# EAGLE board SOM EVAL BOARD V1.1 (EAGLE 9.4.2), part 1 of 2
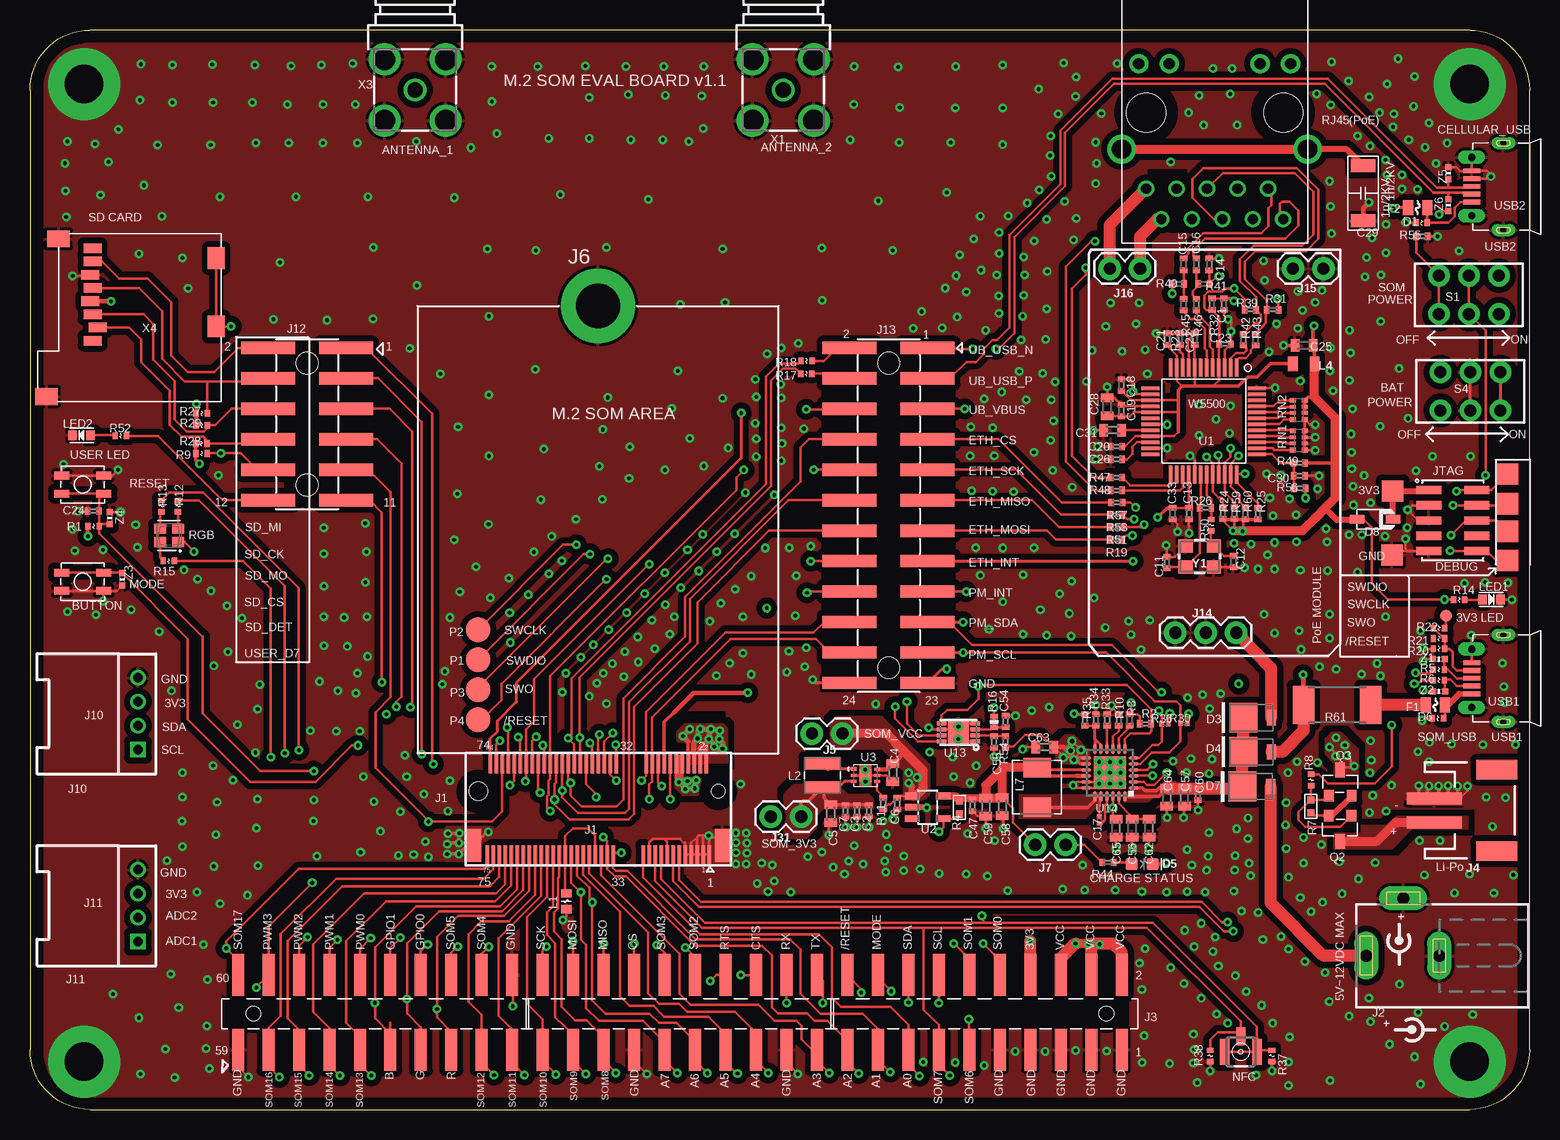
[diagram p3: board, top side]
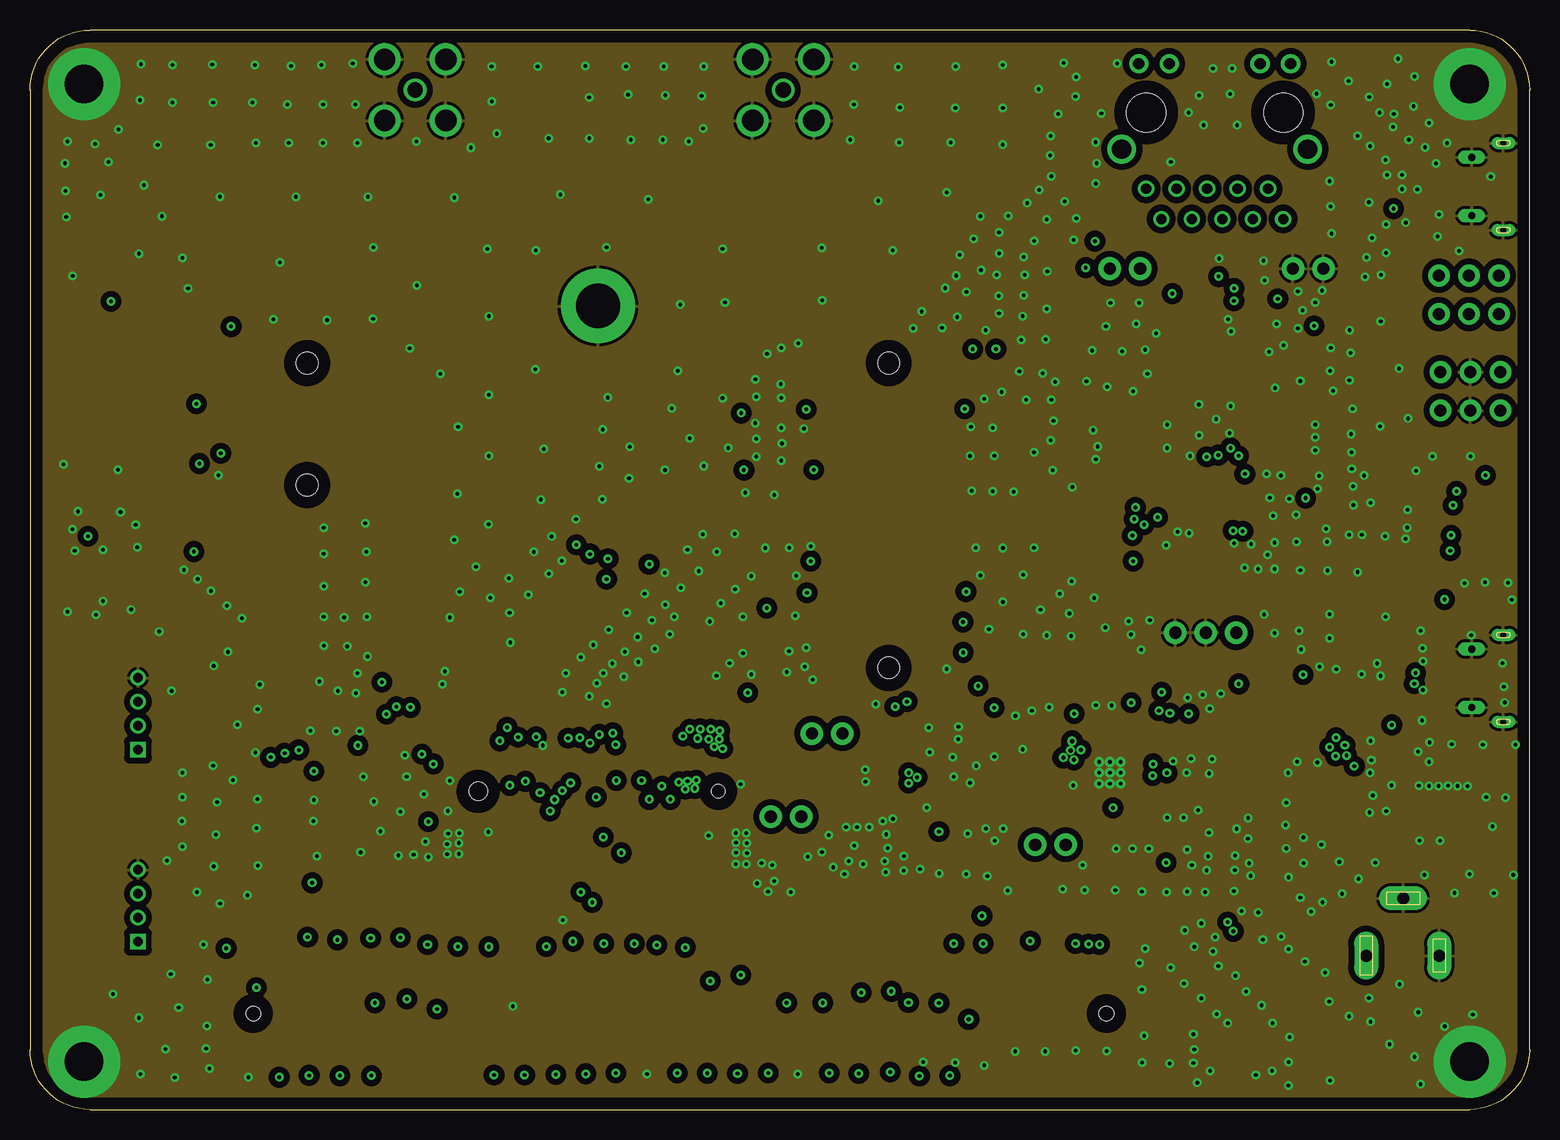
[diagram p4: board, inner layer Route2]
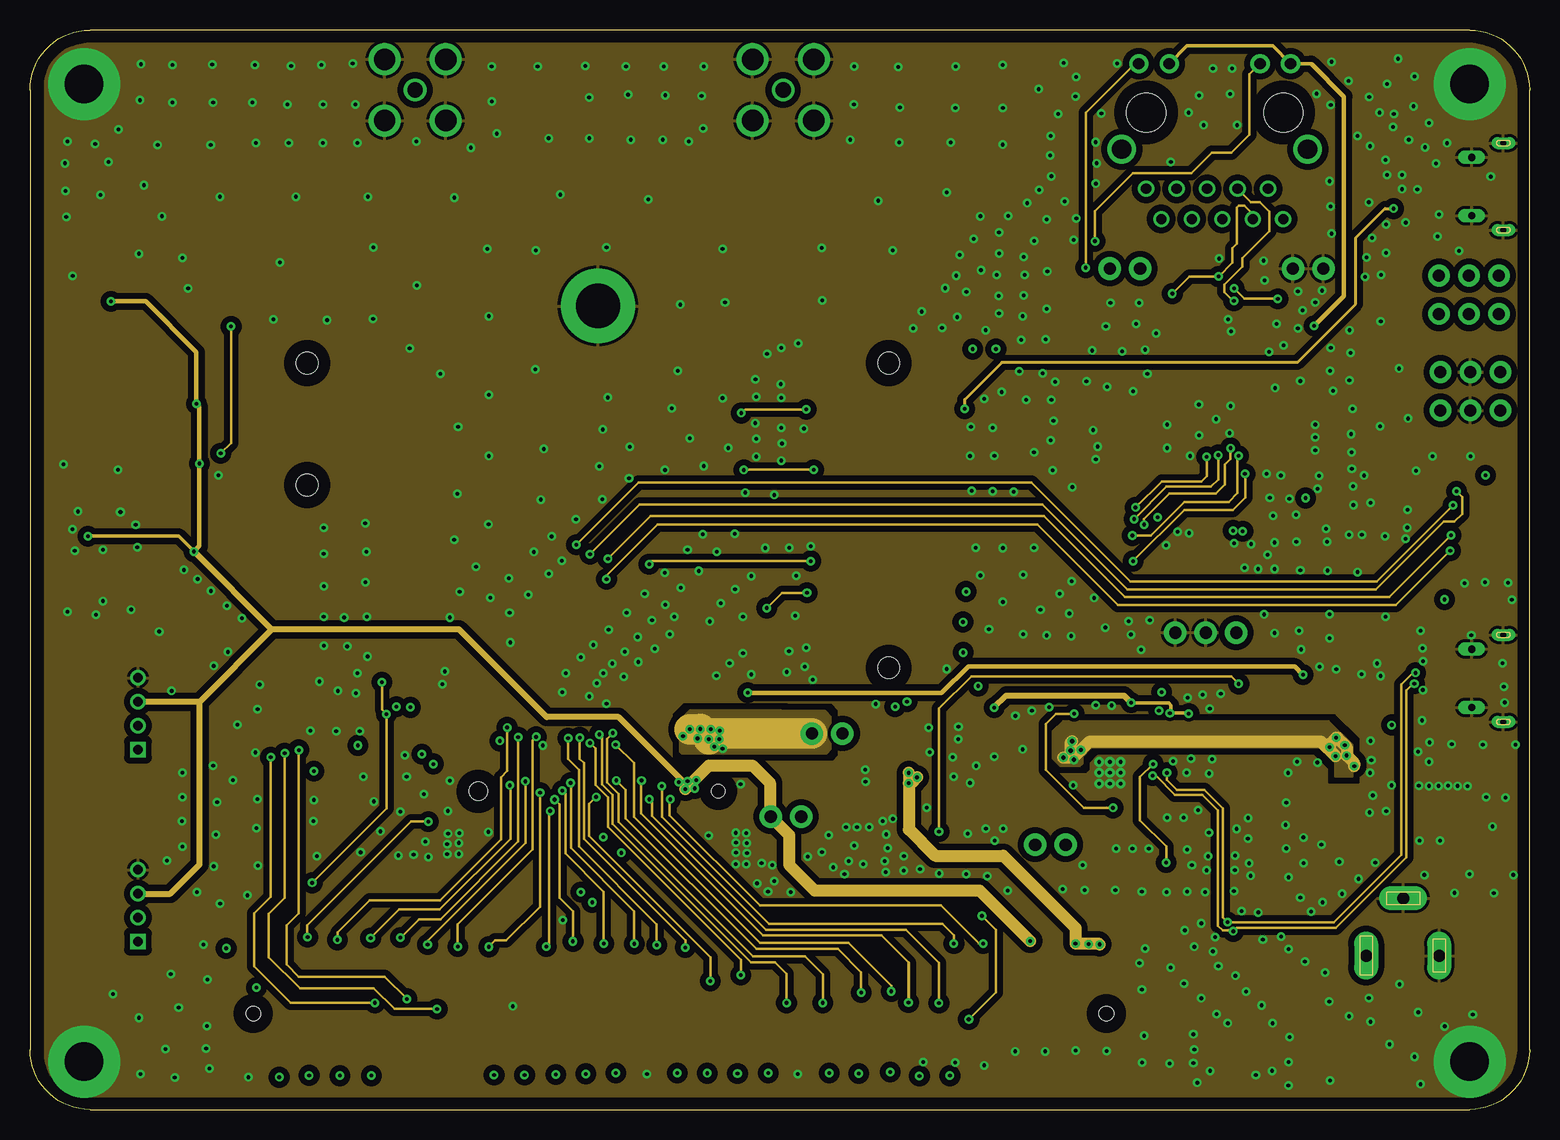
[diagram p5: board, inner layer Route15]
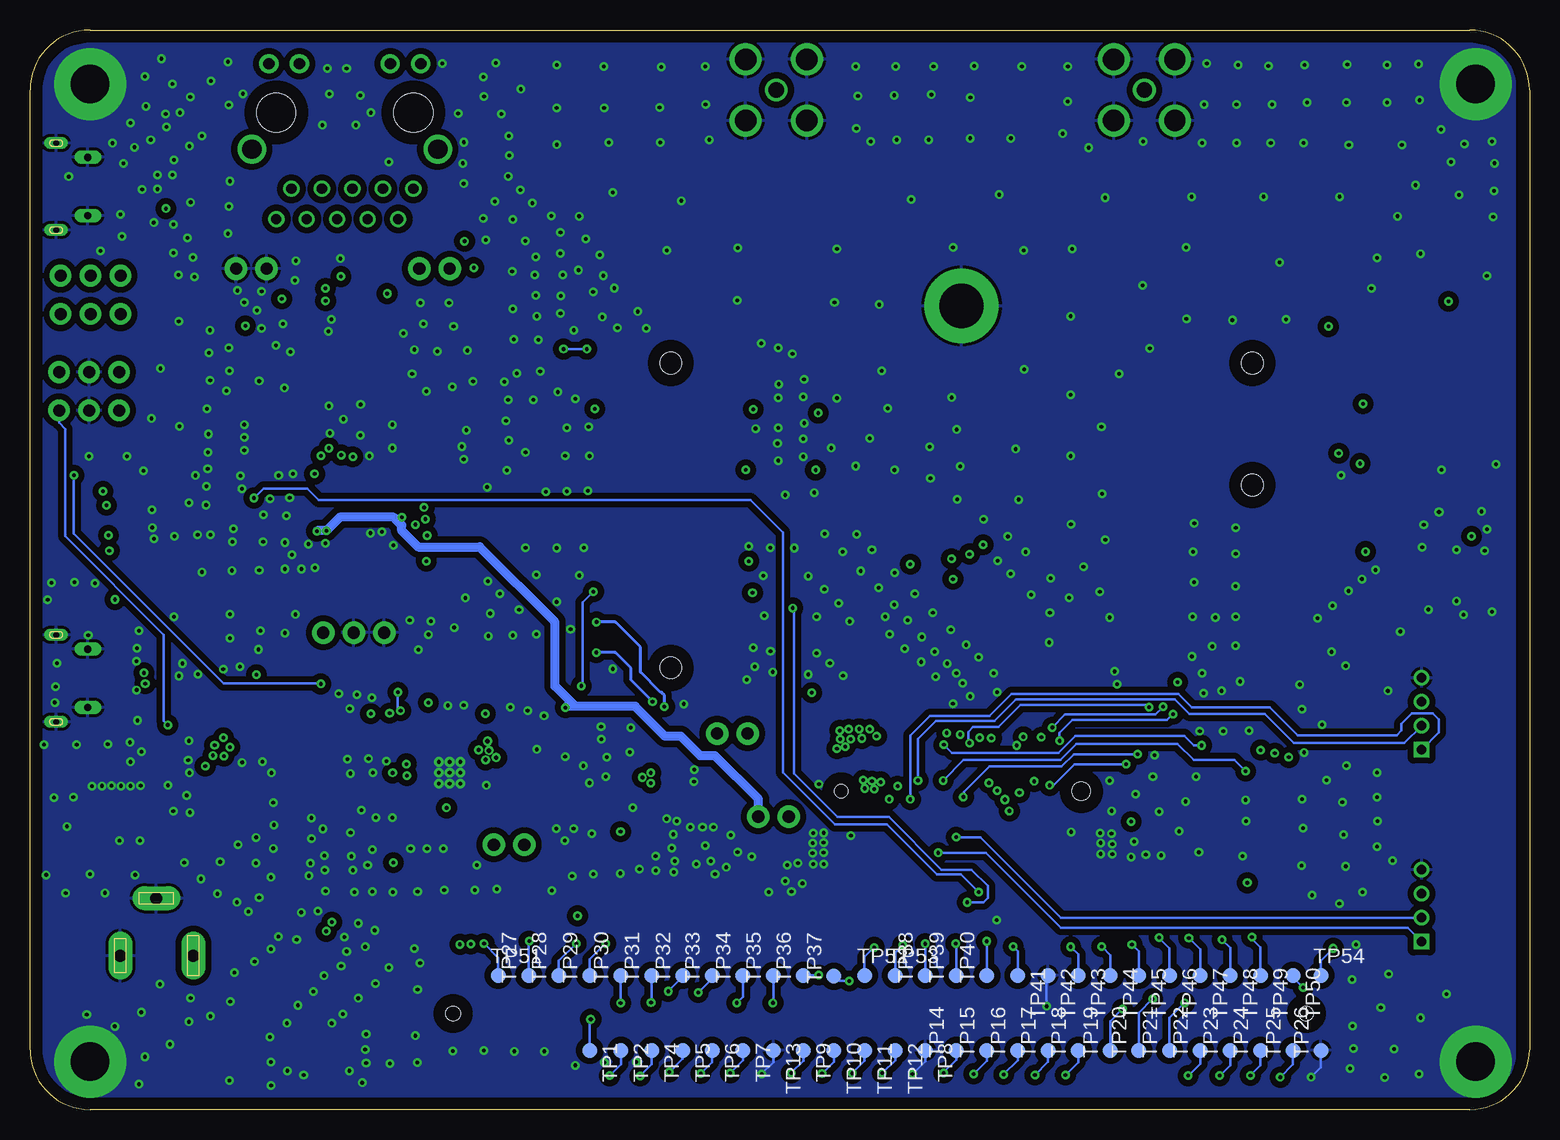
[diagram p6: board, bottom side, seen from below]

Size 125 x 90 mm. Coordinates in mm from the lower left corner, seen from the top.
Outline: 5,0 120,0 arc90 125,5 125,85 arc90 120,90 5,90 arc90 0,85 0,5 arc90 5,0
Copper layers (1+2*15+16): Top 0.035mm / dielectric 1.5mm / Route2 0.035mm / dielectric 0.15mm / Route15 0.035mm / dielectric 0.2mm / Bottom 0.035mm
Design rules "default *": minimum track width 8mil, minimum drill 12mil, track to track 8mil, track to pad 6mil, pad to pad 6mil, via to via 6mil, smd to smd 6mil, copper to edge 40mil, drill to drill 6mil, minimum pad ring 10mil, minimum via ring 8mil, stop-mask expansion 4mil, vias tented up to drill 20mil, thermal gap 10mil
Net classes: 0 default: width 0.152 mm, clearance 0.152 mm; 1 power: width 0.254 mm, drill 0.61 mm, clearance 0.203 mm; 3 BAT: clearance 0.203 mm; 4 3V3: width 0.305 mm, clearance 0.508 mm; 6 +3V3: width 0.203 mm, clearance 0.152 mm

## Footprints (pad centres in the part's own frame; a part is rotated, then mirrored left to right if it is on the bottom)
TS-1185A-020 = smd 1.27 x 0.635: 1 -1.75,0.752; 2 1.75,0.752; 3 -1.75,-0.752; 4 1.75,-0.752
C0402_B = smd 0.457 x 0.61: 1 -0.483,0; 2 0.483,0
C0603_B = smd 0.711 x 1.041: 1 -0.749,0; 2 0.749,0
C0201_B = smd 0.356 x 0.406: 1 -0.279,0; 2 0.279,0
C-1808 = smd 1.1 x 2.05: P$1 -2.285,0; P$2 2.285,0
R-0402S = smd 0.45 x 0.55: 1 -0.47,0; 2 0.47,0
DIODE-DO-220AA_NT(SMP) = smd 0.762 x 1.27: ANODE 2.349,0 | smd 2.337 x 2.464: CATHODE 0,0
LED-0603 = smd 1 x 1: A -0.877,0; C 0.877,0
SOD-123 = smd 1.2 x 0.7: 1 -1.5,0; 2 1.5,0
CON5X2_1.27 = smd 0.7 x 2.1: 1 -2.54,-2; 2 -2.54,2; 3 -1.27,-2; 4 -1.27,2; 5 0,-2; 6 0,2; 7 1.27,-2; 8 1.27,2; 9 2.54,-2; 10 2.54,2
F0805 = smd 0.85 x 1.25: P$1 -0.8,0; P$2 0.8,0
M.2EKEY = smd 0.3 x 1.55: 1 -9.62,3.735; 2 -9.37,-3.815; 3 -9.12,3.735; 4 -8.87,-3.815; 5 -8.62,3.735; 6 -8.37,-3.815; 7 -8.12,3.735; 8 -7.87,-3.815; 9 -7.62,3.735; 10 -7.37,-3.815; 11 -7.12,3.735; 12 -6.87,-3.815; 13 -6.62,3.735; 14 -6.37,-3.815; 15 -6.12,3.735; 16 -5.87,-3.815; 17 -5.62,3.735; 18 -5.37,-3.815; 19 -5.12,3.735; 20 -4.87,-3.815; 21 -4.62,3.735; 22 -4.37,-3.815; 23 -4.12,3.735; 32 -1.87,-3.815; 33 -1.62,3.735; 34 -1.37,-3.815; 35 -1.12,3.735; 36 -0.87,-3.815; 37 -0.62,3.735; 38 -0.37,-3.815; 39 -0.12,3.735; 40 0.13,-3.815; 41 0.38,3.735; 42 0.63,-3.815; 43 0.88,3.735; 44 1.13,-3.815; 45 1.38,3.735; 46 1.63,-3.815; 47 1.88,3.735; 48 2.13,-3.815; 49 2.38,3.735; 50 2.63,-3.815; 51 2.88,3.735; 52 3.13,-3.815; 53 3.38,3.735; 54 3.63,-3.815; 55 3.88,3.735; 56 4.13,-3.815; 57 4.38,3.735; 58 4.63,-3.815; 59 4.88,3.735; 60 5.13,-3.815; 61 5.38,3.735; 62 5.63,-3.815; 63 5.88,3.735; 64 6.13,-3.815; 65 6.38,3.735; 66 6.63,-3.815; 67 6.88,3.735; 68 7.13,-3.815; 69 7.38,3.735; 70 7.63,-3.815; 71 7.88,3.735; 72 8.13,-3.815; 73 8.38,3.735; 74 8.63,-3.815; 75 8.88,3.735 | smd 1.2 x 2.75: 76 9.98,2.96; 77 -10.72,2.96 | hole 1.1: -10.37,-1.54 | hole 1.55: 9.63,-1.54
DCJ0202 = drill 1 pad 2 long: 1 0,3.1; 2 4.8,0; 3 0,-3
SPARK_CON_30X2_SMD = smd 1 x 3.5: 1 0,3.013; 2 0,-3.213; 3 2.54,3.013; 4 2.54,-3.213; 5 5.08,3.013; 6 5.08,-3.213; 7 7.62,3.013; 8 7.62,-3.213; 9 10.16,3.013; 10 10.16,-3.213; 11 12.7,3.013; 12 12.7,-3.213; 13 15.24,3.013; 14 15.24,-3.213; 15 17.78,3.013; 16 17.78,-3.213; 17 20.32,3.013; 18 20.32,-3.213; 19 22.86,3.013; 20 22.86,-3.213; 21 25.4,3.013; 22 25.4,-3.213; 23 27.94,3.013; 24 27.94,-3.213; 25 30.48,3.013; 26 30.48,-3.213; 27 33.02,3.013; 28 33.02,-3.213; 29 35.56,3.013; 30 35.56,-3.213; 31 38.1,3.013; 32 38.1,-3.213; 33 40.64,3.013; 34 40.64,-3.213; 35 43.18,3.013; 36 43.18,-3.213; 37 45.72,3.013; 38 45.72,-3.213; 39 48.26,3.013; 40 48.26,-3.213; 41 50.8,3.013; 42 50.8,-3.213; 43 53.34,3.013; 44 53.34,-3.213; 45 55.88,3.013; 46 55.88,-3.213; 47 58.42,3.013; 48 58.42,-3.213; 49 60.96,3.013; 50 60.96,-3.213; 51 63.5,3.013; 52 63.5,-3.213; 53 66.04,3.013; 54 66.04,-3.213; 55 68.58,3.013; 56 68.58,-3.213; 57 71.12,3.013; 58 71.12,-3.213; 59 73.66,3.013; 60 73.66,-3.213 | hole 1.2: 1.27,0; 72.39,0
JST-2-SMD = smd 1 x 4.6: 1 -1,-3.7; 2 1,-3.7 | smd 1.6 x 3.4: NC1 -3.4,1.5; NC2 3.4,1.5
1X02 = drill 1.016 pad 1.88: 1 0,0; 2 2.54,0
SCREW-HOLE-3.7 = drill 3.7 pad 6.2: P$1 0,0
HW4-2.0-90D = drill 0.8 pad 1.27 square: 1 -3,0 | drill 0.8 pad 1.27: 2 -1,0; 3 1,0; 4 3,0
CON_6*2_SMD_HEADER = smd 1.02 x 4.5: 1 0,0.65; 2 0,-5.85; 3 2.54,0.65; 4 2.54,-5.85; 5 5.08,0.65; 6 5.08,-5.85; 7 7.62,0.65; 8 7.62,-5.85; 9 10.16,0.65; 10 10.16,-5.85; 11 12.7,0.65; 12 12.7,-5.85 | hole 1.8: 1.27,-2.6; 11.43,-2.6
1X03 = drill 1.016 pad 1.88: 1 0,0; 2 2.54,0; 3 5.08,0
CON_12*2_SMD_HEADER = smd 1.02 x 4.5: 1 0,0.65; 2 0,-5.85; 3 2.54,0.65; 4 2.54,-5.85; 5 5.08,0.65; 6 5.08,-5.85; 7 7.62,0.65; 8 7.62,-5.85; 9 10.16,0.65; 10 10.16,-5.85; 11 12.7,0.65; 12 12.7,-5.85; 13 15.24,0.65; 14 15.24,-5.85; 15 17.78,0.65; 16 17.78,-5.85; 17 20.32,0.65; 18 20.32,-5.85; 19 22.86,0.65; 20 22.86,-5.85; 21 25.4,0.65; 22 25.4,-5.85; 23 27.94,0.65; 24 27.94,-5.85 | hole 1.8: 1.27,-2.6; 26.67,-2.6
R-0603A = smd 0.7 x 0.85: 1 -0.65,0; 2 0.65,0
INDUCTOR-VLS-E = smd 1 x 3: P$1 -1,0; P$2 1,0
0805 = smd 0.8 x 1.2: 1 -0.9,0; 2 0.9,0
INDUCTOR-4040 = smd 1.65 x 2.3: P$1 -1.65,0; P$2 1.65,0
LED0603 = smd 0.7 x 0.8: 1 -0.75,0; 2 0.75,0
IPEX-20279-001E = smd 0.73 x 1.5: 1 0,1.28 | smd 0.8 x 2.2: 2@1 -1.35,0; 2@2 1.35,0
SPARK_POGO-2.0 = smd 2.032 x 2.032: P$2 0,0
SOT-23 = smd 0.8 x 0.95: 1 -0.95,-1; 2 0.95,-1 | smd 0.8 x 1.25: 3 0,1.15
R0402_B = smd 0.457 x 0.61: 1 -0.483,0; 2 0.483,0
R0603 = smd 0.6 x 0.6: 1 -0.55,0; 2 0.55,0
0402-RES = smd 0.55 x 0.6: 1 -0.4,0; 2 0.4,0
R2512 = smd 1.8 x 3.2: 1 -2.8,0; 2 2.8,0
PLCC4-2MM-RGB = smd 1 x 0.8: BLUE -0.75,-0.55; CA 0.75,-0.55; GREEN -0.75,0.55; RED 0.75,0.55
ARDUINO-ETHERNET-SHIELD2-V2_CONNETTORI_POE-RJ45 = drill 0.95 pad 1.6: 11 6.81,6.325; 12 6.81,3.785; 13 6.81,-3.785; 14 6.81,-6.325 | drill 1.6: CH1 13.94,7.75; CH2 13.94,-7.75 | drill 0.85 pad 1.3: R1 19.77,5.715; R2 17.23,4.445; R3 19.77,3.175; R4 17.23,1.905; R5 19.77,0.635; R6 17.23,-0.635; R7 19.77,-1.905; R8 17.23,-3.175; R9 19.77,-4.445; R10 17.23,-5.715 | hole 3.25: 10.89,5.715; 10.89,-5.715
4X0402ARV341 = smd 0.4 x 0.5: 1 -0.8,-0.5; 4 0.8,-0.5; 5 0.8,0.5; 8 -0.8,0.5 | smd 0.3 x 0.5: 2 -0.25,-0.5; 3 0.25,-0.5; 6 0.25,0.5; 7 -0.25,0.5
SWITCH-2.5X3.2-6 = drill 1 pad 1.8: 1 0,0; 2 0,2.5; 3 0,5; 4 3.2,0; 5 3.2,2.5; 6 3.2,5
B1,27 = smd 1.27 x 1.27: TP 0,0
TP = smd 1 x 1: P$1 0,0
W5500 = smd 1.5 x 0.3: 1 -4.45,2.75; 2 -4.45,2.25; 3 -4.45,1.75; 4 -4.45,1.25; 5 -4.45,0.75; 6 -4.45,0.25; 7 -4.45,-0.25; 8 -4.45,-0.75; 9 -4.45,-1.25; 10 -4.45,-1.75; 11 -4.45,-2.25; 12 -4.45,-2.75; 25 4.45,-2.75; 26 4.45,-2.25; 27 4.45,-1.75; 28 4.45,-1.25; 29 4.45,-0.75; 30 4.45,-0.25; 31 4.45,0.25; 32 4.45,0.75; 33 4.45,1.25; 34 4.45,1.75; 35 4.45,2.25; 36 4.45,2.75 | smd 0.3 x 1.5: 13 -2.75,-4.45; 14 -2.25,-4.45; 15 -1.75,-4.45; 16 -1.25,-4.45; 17 -0.75,-4.45; 18 -0.25,-4.45; 19 0.25,-4.45; 20 0.75,-4.45; 21 1.25,-4.45; 22 1.75,-4.45; 23 2.25,-4.45; 24 2.75,-4.45; 37 2.75,4.45; 38 2.25,4.45; 39 1.75,4.45; 40 1.25,4.45; 41 0.75,4.45; 42 0.25,4.45; 43 -0.25,4.45; 44 -0.75,4.45; 45 -1.25,4.45; 46 -1.75,4.45; 47 -2.25,4.45; 48 -2.75,4.45
SOT25 = smd 0.55 x 1.2: 1 -0.95,-1.3; 2 0,-1.3; 3 0.95,-1.3; 4 0.95,1.3; 5 -0.95,1.3
USP-6C = smd 0.45 x 0.35: 1 -0.975,0.55 | smd 0.45 x 0.25: 2 -0.975,0; 3 -0.975,-0.5; 4 0.975,-0.5; 5 0.975,0; 6 0.975,0.5 | smd 1.016 x 1.016: P$1 0,0
TDFN-8 = smd 0.8 x 0.3: 1 -1.4,0.75; 2 -1.4,0.25; 3 -1.4,-0.25; 4 -1.4,-0.75; 5 1.4,-0.75; 6 1.4,-0.25; 7 1.4,0.25; 8 1.4,0.75 | smd 1.73 x 1.88: EP 0,0
QFN24 = smd 0.85 x 0.28: 1 -1.975,1.25; 2 -1.975,0.75; 3 -1.975,0.25; 4 -1.975,-0.25; 5 -1.975,-0.75; 6 -1.975,-1.25; 13 1.975,-1.25; 14 1.975,-0.75; 15 1.975,-0.25; 16 1.975,0.25; 17 1.975,0.75; 18 1.975,1.25 | smd 0.28 x 0.85: 7 -1.25,-1.975; 8 -0.75,-1.975; 9 -0.25,-1.975; 10 0.25,-1.975; 11 0.75,-1.975; 12 1.25,-1.975; 19 1.25,1.975; 20 0.75,1.975; 21 0.25,1.975; 22 -0.25,1.975; 23 -0.75,1.975; 24 -1.25,1.975 | smd 2.7 x 2.7: PAD 0,0 | drill 0.3 pad 0.406: PAD@1 -0.9,0.9; PAD@2 0,0.9; PAD@3 0.9,0.9; PAD@4 -0.9,0; PAD@5 0,0; PAD@6 0.9,0; PAD@7 -0.9,-0.9; PAD@8 0,-0.9; PAD@9 0.9,-0.9
TP70_BOT = smd 1.778 x 1.778 bottom: P$1 0,0
MICRO_USB = smd 0.4 x 1.4: 1 1.3,0.1; 2 0.65,0.1; 3 0,0.1; 4 -0.65,0.1; 5 -1.3,0.1 | drill 0.6 pad 0.75 long: 6 2.425,0.1 | drill 0.5 pad 1 long: 7 3.625,2.75; 8 -3.625,2.75 | drill 0.6 pad 0.65 long: 9 -2.425,0.1
BU-SMA-G = drill 1.27: 1 0,0 | drill 1.778: 2 -2.55,2.55; 3 2.55,2.55; 4 2.55,-2.55; 5 -2.55,-2.55
SDCARD-15TW-8821 = smd 0.8 x 1.5: 1 0,0; 2 1.1,-0.4; 3 2.2,0; 4 3.3,0.2; 5 4.4,0; 6 5.5,0.2; 7 6.6,0; 8 7.7,0 | smd 1.4 x 1.9: GND1 -4.66,3.85; GND2 8.49,2.85 | smd 1.8 x 1.4: GND3 1.19,-10.3; GND4 6.89,-10.3
CRYSTAL-SMD-3.2X2.5MM = smd 1.2 x 1.1: 1 -1.175,-0.875; 2 1.175,-0.875; 3 1.175,0.875; 4 -1.175,0.875
SMD-0402MP = smd 0.5 x 0.5: 1 -0.508,0; 2 0.508,0

## Placement (x,y rotation side)
BUTTON  TS-1185A-020  [TS-1185A-020]  4.4,44 0 top
C1  0.1uF  [C0402_B]  99.52,67.13 90 top
C2  1000pF  [C0402_B]  69.93,24.89 90 top
C3  100pF  [C0402_B]  68.94,24.89 90 top
C4  10uF  [C0603_B]  71.94,28.07 270 top
C5  10uF  [C0603_B]  66.75,24.66 270 top
C6  0.1uF  [C0402_B]  72.29,25.5 90 top
C7  0.1uF  [C0402_B]  67.97,24.89 90 top
C11  18pF  [C0402_B]  94.77,45.59 270 top
C12  18pF  [C0402_B]  100.33,45.67 90 top
C13  0.1uF  [C0402_B]  96.62,49.68 90 top
C14  10nF  [C0402_B]  98.3,70.46 270 top
C15  6.8nF  [C0402_B]  96.17,70.46 90 top
C16  6.8nF  [C0402_B]  97.23,70.46 90 top
C17  47nF  [C0201_B]  89.16,24.13 90 top
C18  0.1uF  [C0402_B]  90.99,60.4 270 top
C19  0.1uF  [C0402_B]  90.99,58.27 270 top
C20  0.1uF  [C0402_B]  90.58,55.27 0 top
C21  0.1uF  [C0402_B]  94.8,64.21 270 top
C22  0.1uF  [C0402_B]  97.08,64.21 270 top
C23  0.1uF  [C0402_B]  99.62,63.81 180 top
C24  0.1uF  [C0402_B]  5.27,49.9 0 top
C25  10uF  [C0603_B]  106.2,63.7 180 top
C26  10nF  [C0402_B]  90.58,54.21 0 top
C28  10uF  [C0603_B]  89.79,58.57 90 top
C29  1n/2KV  [C-1808]  111.13,76.4 270 top
C30  0.1uF  [C0402_B]  105.82,52.83 180 top
C31  4.7uF  [C0603_B]  90.25,56.64 180 top
C33  0.1uF  [C0402_B]  95.25,49.68 90 top
C47  1nF/10V  [C0402_B]  78.56,25.35 270 top
C54  10nF  [C0402_B]  81.33,32.35 90 top
C55  1uF  [C0402_B]  80.36,30.64 270 top
C56  10uF  [C0603_B]  91.87,23.47 270 top
C57  10uF  [C0603_B]  96.23,26.03 270 top
C58  10uF  [C0603_B]  81.05,25.25 270 top
C59  10uF  [C0603_B]  79.68,25.22 270 top
C60  1uF  [C0402_B]  97.36,26.27 270 top
C62  10uF  [C0603_B]  93.27,23.47 270 top
C63  10uF  [C0603_B]  84.58,30.23 180 top
C64  10uF  [C0603_B]  94.76,26.03 270 top
C65  4.7uF  [C0603_B]  90.53,23.47 270 top
D1  ESD  [R-0402S]  116,73.94 0 top
D3  SS3P3-M3/84A  [DIODE-DO-220AA_NT(SMP)]  101.13,32.67 0 top
D4  SS3P3-M3/84A  [DIODE-DO-220AA_NT(SMP)]  101.13,29.82 0 top
D5  yellow  [LED-0603]  92.71,20.47 0 top
D6  ESD  [R-0402S]  117.35,32.62 0 top
D7  SS3P3-M3/84A  [DIODE-DO-220AA_NT(SMP)]  101.07,26.94 0 top
D8  B5819w  [SOD-123]  112.12,49.2 0 top
DEBUG  CON5X2  [CON5X2_1.27]  118.6,49.1 270 top
F1  6V 1A  [F0805]  117.15,33.73 180 top
F2  6V 1A  [F0805]  115.67,75.19 180 top
J1  TE 2199230-4  [M.2EKEY]  47,25 180 top
J2  DCJ0202  [DCJ0202]  114.48,12.82 90 top
J3  SPARK_CON_30X2_SMD  [SPARK_CON_30X2_SMD]  91,8 180 top
J4  [JST-2-SMD]  120.76,24.94 270 top
J5  [1X02]  65.18,31.35 0 top
J6  SCREW-HOLE-3.7  [SCREW-HOLE-3.7]  47.35,67 0 top
J7  [1X02]  86.34,22.07 180 top
J10  4P-2.0-90D  [HW4-2.0-90D]  9,33 90 top
J11  4P-2.0-90D  [HW4-2.0-90D]  9,17 90 top
J12  CON_62_SMD_HEADER  [CON_6*2_SMD_HEADER]  25.7,63.5 270 top
J14  [1X03]  100.55,39.75 180 top
J15  [1X02]  105.28,70.11 0 top
J16  [1X02]  90.01,70.11 0 top
J31  [1X02]  64.29,24.41 180 top
J35  CON_122_SMD_HEADER  [CON_12*2_SMD_HEADER]  74.18,63.5 270 top
L1  GZ1608D300TF  [R-0603A]  44.71,17.37 90 top
L2  NR3015T2R2M  [INDUCTOR-VLS-E]  66.04,27.86 270 top
L4  3.3µH  [0805]  106.17,62.18 180 top
L7  2.2uH  [INDUCTOR-4040]  83.94,26.86 90 top
LED1  GREEN  [LED0603]  121.82,42.52 0 top
LED2  GREEN  [LED0603]  4.3,56.21 180 top
NFC  UFL  [IPEX-20279-001E]  100.93,4.81 0 top
P1  SPARK_POGOPIN  [SPARK_POGO-2.0]  37.35,37.5 0 top
P2  SPARK_POGOPIN  [SPARK_POGO-2.0]  37.35,40 0 top
P3  SPARK_POGOPIN  [SPARK_POGO-2.0]  37.35,35 0 top
P4  SPARK_POGOPIN  [SPARK_POGO-2.0]  37.35,32.5 0 top
Q2  IR6401  [SOT-23]  109.2,23.51 180 top
Q3  IR6401  [SOT-23]  109.22,27.15 0 top
R1  ?10K  [R-0402S]  5.3,48.63 180 top
R2  10K  [R0402_B]  92.99,32.16 0 top
R3  10K  [R0402_B]  91.67,32.46 270 top
R4  100K  [R0603]  77.47,25.17 90 top
R5  0R  [R-0402S]  117.43,36.68 0 top
R6  0R  [R-0402S]  117.43,35.79 0 top
R7  100K  [R0603]  106.76,25.27 270 top
R8  1K  [R-0402S]  106.78,27.48 90 top
R9  47K  [R-0402S]  14.3,54.68 180 top
R10  10K  [R0402_B]  90.76,32.46 270 top
R11  10K  [R0402_B]  71.12,25.5 90 top
R12  1K  [R-0402S]  12.35,50.3 270 top
R13  1K  [R-0402S]  10.95,50.3 270 top
R14  1K  [R-0402S]  119.13,42.5 0 top
R15  1K  [R-0402S]  11.57,45.74 180 top
R16  150  [0402-RES]  80.37,32.32 90 top
R17  0R  [R-0402S]  64.71,61.35 180 top
R18  0R  [R-0402S]  64.74,62.41 180 top
R19  33R  [R0402_B]  90.58,47.51 180 top
R20  0R  [R-0402S]  117.45,38.41 180 top
R21  ?0R  [R-0402S]  117.45,39.27 180 top
R22  ?10K  [R-0402S]  117.45,40.13 0 top
R23  12.4k  [R0402_B]  95.86,64.21 270 top
R24  10k  [R0402_B]  99.44,49.73 270 top
R25  10k  [R0402_B]  102.36,49.68 270 top
R26  1M  [R0402_B]  98,50.17 180 top
R27  ?47K  [R-0402S]  14.32,58.03 0 top
R28  47K  [R-0402S]  14.29,55.52 0 top
R29  47K  [R-0402S]  14.32,57.05 0 top
R30  4K7  [C0201_B]  96.19,32.17 180 top
R31  49R9  [R0402_B]  103.58,66.68 0 top
R32  10R  [R0402_B]  98.53,67.13 270 top
R33  330R  [R0402_B]  89.79,32.46 90 top
R34  10K  [R0402_B]  88.85,32.46 90 top
R35  5.49K  [R0402_B]  87.94,32.46 270 top
R36  4K7  [C0201_B]  94.61,32.16 180 top
R37  ESD NC  [R-0402S]  103.52,4.47 270 top
R38  ESD NC  [R-0402S]  98.38,4.47 90 top
R39  49R9  [R0402_B]  101.73,66.68 180 top
R40  49R9  [R0402_B]  95.71,68.84 0 top
R41  49R9  [R0402_B]  97.84,68.84 180 top
R42  33R  [R0402_B]  101.15,64.19 270 top
R43  33R  [R0402_B]  102.16,64.19 270 top
R44  1K  [R0402_B]  89.84,20.6 180 top
R45  33R  [R0402_B]  96.17,67.11 270 top
R46  33R  [R0402_B]  97.23,67.11 270 top
R47  330R  [R0402_B]  90.58,52.68 0 top
R48  330R  [R0402_B]  90.58,51.61 0 top
R49  10K  [R0402_B]  105.82,53.9 0 top
R50  0R  [R-0402S]  98.45,48.72 270 top
R51  33R  [R0402_B]  90.58,48.56 180 top
R52  1K  [R-0402S]  7.57,56.16 180 top
R53  33R  [R0402_B]  90.58,49.6 180 top
R54  1K  [R0402_B]  81.31,30.66 90 top
R55  1K  [R0402_B]  116.03,72.8 0 top
R56  33R  [R0402_B]  105.84,51.79 0 top
R57  33R  [R0402_B]  90.6,50.6 180 top
R59  ?10k  [R0402_B]  100.4,49.72 270 top
R60  10k  [R0402_B]  101.32,49.71 270 top
R61  0.001Ω ±1% 3W  [R2512]  108.97,33.73 180 top
RESET  TS-1185A-020  [TS-1185A-020]  4.4,52.1 0 top
RGB  RGB-LED-CLMVB-FKARGB  [PLCC4-2MM-RGB]  11.6,47.86 0 top
RJ45  HY931147A  [ARDUINO-ETHERNET-SHIELD2-V2_CONNETTORI_POE-RJ45]  98.76,94 270 top
RN1  10k  [4X0402ARV341]  105.77,55.78 90 top
RN2  10k  [4X0402ARV341]  105.77,58.32 90 top
S1  [SWITCH-2.5X3.2-6]  122.45,66.32 90 top
S4  [SWITCH-2.5X3.2-6]  117.58,61.48 270 top
TP1  TPSB1,27  [B1,27]  78.33,4.93 270 bottom
TP2  TPSB1,27  [B1,27]  75.74,4.93 270 bottom
TP3  TPTP  [TP]  118.04,41.15 0 top
TP4  TPSB1,27  [B1,27]  73.18,4.93 270 bottom
TP5  TPSB1,27  [B1,27]  70.6,4.93 270 bottom
TP6  TPSB1,27  [B1,27]  68.14,4.93 270 bottom
TP7  TPSB1,27  [B1,27]  65.57,4.93 270 bottom
TP8  TPSB1,27  [B1,27]  50.37,4.93 270 bottom
TP9  TPSB1,27  [B1,27]  60.53,4.93 270 bottom
TP10  TPSB1,27  [B1,27]  57.99,4.93 270 bottom
TP11  TPSB1,27  [B1,27]  55.43,4.93 270 bottom
TP12  TPSB1,27  [B1,27]  52.87,4.93 270 bottom
TP13  TPSB1,27  [B1,27]  63.04,4.93 270 bottom
TP14  TPSB1,27  [B1,27]  47.79,4.93 90 bottom
TP15  TPSB1,27  [B1,27]  45.23,4.93 90 bottom
TP16  TPSB1,27  [B1,27]  42.65,4.93 90 bottom
TP17  TPSB1,27  [B1,27]  40.14,4.93 90 bottom
TP18  TPSB1,27  [B1,27]  37.62,4.93 90 bottom
TP19  TPSB1,27  [B1,27]  34.95,4.93 90 bottom
TP20  TPSB1,27  [B1,27]  32.58,4.93 90 bottom
TP21  TPSB1,27  [B1,27]  30.01,4.93 90 bottom
TP22  TPSB1,27  [B1,27]  27.45,4.93 90 bottom
TP23  TPSB1,27  [B1,27]  24.95,4.93 90 bottom
TP24  TPSB1,27  [B1,27]  22.43,4.93 90 bottom
TP25  TPSB1,27  [B1,27]  19.72,4.93 90 bottom
TP26  TPSB1,27  [B1,27]  17.39,4.93 90 bottom
TP27  TPSB1,27  [B1,27]  83.43,11.17 90 bottom
TP28  TPSB1,27  [B1,27]  80.92,11.17 90 bottom
TP29  TPSB1,27  [B1,27]  78.33,11.17 90 bottom
TP30  TPSB1,27  [B1,27]  75.74,11.17 90 bottom
TP31  TPSB1,27  [B1,27]  73.18,11.17 90 bottom
TP32  TPSB1,27  [B1,27]  70.6,11.17 90 bottom
TP33  TPSB1,27  [B1,27]  68.14,11.17 90 bottom
TP34  TPSB1,27  [B1,27]  65.57,11.17 90 bottom
TP35  TPSB1,27  [B1,27]  63.04,11.17 90 bottom
TP36  TPSB1,27  [B1,27]  60.53,11.17 90 bottom
TP37  TPSB1,27  [B1,27]  57.99,11.12 90 bottom
TP38  TPSB1,27  [B1,27]  50.37,11.17 90 bottom
TP39  TPSB1,27  [B1,27]  47.79,11.17 90 bottom
TP40  TPSB1,27  [B1,27]  45.23,11.17 90 bottom
TP41  TPSB1,27  [B1,27]  42.65,11.17 270 bottom
TP42  TPSB1,27  [B1,27]  40.14,11.17 270 bottom
TP43  TPSB1,27  [B1,27]  37.62,11.17 270 bottom
TP44  TPSB1,27  [B1,27]  34.95,11.17 270 bottom
TP45  TPSB1,27  [B1,27]  32.58,11.17 270 bottom
TP46  TPSB1,27  [B1,27]  30.01,11.17 270 bottom
TP47  TPSB1,27  [B1,27]  27.45,11.17 270 bottom
TP48  TPSB1,27  [B1,27]  24.95,11.17 270 bottom
TP49  TPSB1,27  [B1,27]  22.43,11.17 270 bottom
TP50  TPSB1,27  [B1,27]  19.72,11.17 270 bottom
TP51  TPSB1,27  [B1,27]  85.96,11.17 0 bottom
TP52  TPSB1,27  [B1,27]  55.43,11.17 0 bottom
TP53  TPSB1,27  [B1,27]  52.87,11.17 0 bottom
TP54  TPSB1,27  [B1,27]  17.39,11.17 0 bottom
U1  W5500  [W5500]  97.84,57.39 270 top
U2  XC8107SOT25  [SOT25]  74.83,25.2 270 top
U3  XC9258A  [USP-6C]  69.65,27.84 0 top
U13  MAX1704X  [TDFN-8]  77.39,31.44 180 top
U14  BQ24195L  [QFN24]  90.02,28.08 180 top
U$1  TP2  [TP70_BOT]  113.59,51.56 0 bottom
U$2  TP2  [TP70_BOT]  113.54,46.23 0 bottom
U$9  TP2  [TP70_BOT]  123.17,52.99 0 bottom
U$10  TP2  [TP70_BOT]  123.17,50.5 0 bottom
U$11  TP2  [TP70_BOT]  123.17,48.21 0 bottom
U$12  TP2  [TP70_BOT]  123.17,45.77 0 bottom
USB1  MICRO_USB_5P  [MICRO_USB]  120.08,35.95 270 top
USB2  MICRO_USB_5P  [MICRO_USB]  120.08,76.95 270 top
X1  BU-SMA-G  [BU-SMA-G]  62.79,85 90 top
X3  BU-SMA-G  [BU-SMA-G]  32.11,85 90 top
X4  0046_15TW-882  [SDCARD-15TW-8821]  5.23,64.09 90 top
Y1  25MHz  [CRYSTAL-SMD-3.2X2.5MM]  97.51,46.1 180 top
Z1  PESD0402MP  [SMD-0402MP]  117.43,37.54 0 top
Z2  PESD0402MP  [SMD-0402MP]  117.45,34.85 0 top
Z3  PESD0402MP  [SMD-0402MP]  7.69,44.2 90 top
Z4  PESD0402MP  [SMD-0402MP]  6.65,49.31 270 top
Z5  PESD0402MP  [SMD-0402MP]  118.24,78.06 270 top
Z6  PESD0402MP  [SMD-0402MP]  118.24,75.39 90 top

## Tracks (layer width: path | path; a pad name or v marks a point on that pad's centre or on a via)
3V3  (via drill 0.3 pad 0.41, 0.3 pad 0.51)
  Top 0.203: RGB.CA 12.88,47.31 v13.67,46.52
  Top 0.305: J1.12 53.87,27.66 54.15,27.38 | J1.10 54.37,27.6 | R28.1 13.83,55.51 R9.2 13.83,54.14 v14.12,53.85 | R29.1 R27.1 13.85,58.8 v13.87,58.83 | R1.2 v4.83,47.81 v4.83,47.8
  Top 0.381: 54.37,27.6 54.15,27.38 | 54.15,27.38 v54.81,27.38 54.89,27.46 v55.55,27.46 55.42,27.33 v55.42,26.77 54.69,26.77 v54.63,26.72 54.63,26.75 v54.08,27.3 | 54.15,27.38 v54.08,27.3 | v54.08,27.3 54.08,29.36 54.13,29.41 54.13,29.06 54.32,28.86 54.32,28.82 | X4.4 v6.75,67.39 v6.76,67.39
  Top 1.016: J3.8 83.38,14.04 v83.39,14.05
  Route15 0.305: v4.83,47.8 12.39,47.8 v13.67,46.52
  Route15 0.381: v6.76,67.39 9.63,67.39 13.87,63.14 v13.87,58.83 14.12,58.57 v14.12,53.85 14.12,46.97 v13.67,46.52
  Route15 0.508: v54.63,26.72 54.63,27.15 49.07,32.72 43.08,32.72 35.76,40.03 20.16,40.03 | v13.67,46.52 20.16,40.03 | 20.16,40.03 14.13,34 | 14.13,34 J10.3 | J11.3 11.7,18 14.13,20.43 14.13,34
  Route15 1.016: v54.63,26.72 56.59,28.68 60.23,28.68 61.67,27.23 61.67,24.49 J31.2 63.27,22.89 63.27,20.4 65.41,18.26 79.15,18.26 83.36,14.05 v83.39,14.05
  Bottom 0.203: TP27.TP 83.43,14.01 v83.39,14.05
  pour Top (isolate 0.279): 53.72,29.67 53.72,26.9 54.38,26.24 55.65,26.24 55.96,26.54 55.96,27.48 55.65,27.79 54.43,27.79 54.43,29.67
!CE
  Top 0.203: U14.9 90.27,31.09 90.76,31.57 R10.2
!ETH_INT  (via drill 0.3 pad 0.51)
  Top 0.203: R25.1 102.36,50.5 100.59,52.27 U1.36 100.64,52.99 v101.27,52.99
  Top 0.254: J35.15 v91.95,45.72
  Route15 0.203: v101.27,52.99 101.3,52.96 101.3,51.01 100.28,49.99 96.22,49.99 v91.95,45.72
!FUEL-INT  (via drill 0.3 pad 0.41, 0.3 pad 0.51)
  Top 0.203: U13.5 75.99,32.84 76.48,33.33 78.13,33.33 79.05,34.24 v79.05,35.31 79.12,35.38 91.44,35.38 93.47,33.36 R2.2 93.47,31.55 93.29,31.37 91.74,31.37 91.27,30.9 U14.7 | J35.17 v78.03,43.18
  Bottom 0.203: v78.03,43.18 78.94,42.27 78.94,35.41 v79.05,35.31
!RESET
  Top 0.203: U1.37 103.51,54.63 104.24,53.9 R49.1 C30.2 105.34,51.82 R56.1
+3V3  (via drill 0.3 pad 0.51, 0.3 pad 0.64)
  Top 0.203: C33.2 C13.2 96.59,50.2 U1.28 | R14.1 118.63,42.52 v117.91,42.52 113.19,42.52 111.86,43.84 111.86,48.53 111.19,49.2 D8.1 | R16.2 v80.37,33.5 | 107.08,65.29 v107.04,65.33 | 106.73,49.2 107.09,49.2 | v91.8,33.91 91.8,33.07 R3.1 92.33,32.95 92.5,32.77 R2.1 | 66.18,26.72 L2.P$2 | 64.32,24.44 J31.1 | R36.1 94.89,32.92 v95.02,33.05 | R30.1 96.47,32.87 v96.6,32.99 | R59.2 100.4,48.41 100.27,48.27 | R25.2 102.06,49.2 | 100.27,48.27 101.13,48.27 101.13,49.04 R60.2 | R24.2 99.44,49.1 100.27,48.27
  Top 0.254: 107.08,61.98 107.08,63.58 C25.1 106.95,63.83 106.95,65.17 | U3.3 67.91,27.34 67.17,26.61
  Top 0.305: L4.1 | L4.1 107.08,61.98 | 106.38,53.98 R49.2 108.72,53.9 108.82,54 | R25.2 99.49,49.2 R24.2 | 106.73,49.2 107.01,49.2 107.14,49.33 | 100.27,48.27 v100.28,48.26 | C33.2 94.8,50.17 v94.01,49.38 | RN2.2 RN2.3 RN2.4 106.52,59.38 107.08,59.38 | L4.1 107.08,63.71 106.95,63.83 | C25.1 106.95,65.17 107.08,65.29 | C2.2 C3.2 C7.2 67.94,25.41 C5.1 66.19,25.97 66.19,26.61 66.19,26.86 L2.P$2 64.9,25.72 64.45,25.72 64.29,25.55 J31.1
  Top 0.381: 67.17,26.61 66.19,26.61 | 65.06,26.56 65.05,26.57 65.34,26.86 L2.P$2 | 108.07,50 107.94,50.13
  Top 0.508: 108.07,50 108.94,49.12 110.54,49.12 D8.1
  Top 0.762: 107.08,61.98 107.08,59.38 108.82,57.63 108.82,54 108.82,51.01 107.94,50.13 107.14,49.33 106.07,48.26 v100.28,48.26
  Route15 0.203: 96.55,33.05 v96.6,32.99
  Route15 0.305: 80.44,33.58 81.38,34.52 | v91.8,33.91 94.92,33.91 95.12,33.71 95.12,33.15 v95.02,33.05 96.55,33.05 | 106.84,87.14 106.79,87.19 RJ45.11 103.6,88.67 96.45,88.67 RJ45.13
  Route15 0.381: v107.04,65.33 109.53,67.82 109.53,84.46 106.84,87.14
  Route15 0.508: v80.37,33.5 81.38,34.52 91.19,34.52 v91.8,33.91
  Bottom 0.762: J31.1 64.29,25.88 67.9,29.49 69.12,29.49 70.74,31.11 72.06,31.11 74.55,33.61 79.53,33.61 | v101.09,48.21 101.04,48.26 v100.28,48.26 99.16,49.38 94.7,49.38 94.38,49.06 | 79.53,33.61 81.23,35.31 81.23,40.64 87.5,46.91 92.66,46.91 94.01,48.26 94.01,48.69 94.38,49.06 | 79.53,33.61 80.27,33.61 v80.37,33.5 | 94.38,49.06 94.33,49.06 v94.01,49.38
  pour Top (isolate 0.279, no thermals): 70.31,25.07 66.14,25.07 65.51,24.44 65.51,23.39 64.67,22.56 63.3,22.56 62.84,23.01 62.84,26.32 63.68,27.15 67.29,27.15 68.13,26.32 69.93,26.32 70.31,25.93
+3V3A  (via drill 0.3 pad 0.51)
  Top 0.203: C22.2 U1.8 97.09,60.31 97.08,60.3 | C21.2 94.8,63.65 95.59,62.86 U1.11 95.59,60.73 96.02,60.3 | C18.2 91.77,59.13 U1.15 95.69,59.13 95.71,59.16 | 95.63,58.09 95.59,58.13 U1.17 92.02,58.13 91.67,57.79 C19.2 90.95,57.83 C28.1 | 95.63,58.09 95.71,58.02 95.71,56.49 95.35,56.13 U1.21 92.15,56.13 91.32,55.3 91.09,55.3 C20.2 | 95.63,58.24 95.63,58.09 | 96.47,60.3 97.08,60.3 | 97.08,60.3 98.61,60.3 99.09,60.78 U1.4 99.09,63.76 C23.2 99.14,66.04 R32.2 98.05,66.65 97.89,66.8 97.89,67.87 98.22,68.2 99.39,68.2 99.65,68.45 v100.38,68.45 101.25,67.59 R39.2 | R31.2 104.07,67.54 v104.02,67.59
  Top 0.305: L4.2 103.38,62.18 102.26,61.06 101.5,61.06 100.74,60.3 96.47,60.3 96.02,60.3 95.71,60 95.71,59.16 95.71,56.49
  Route15 0.203: v104.02,67.59 101.25,67.59 v100.38,68.45
/RESET  (via drill 0.3 pad 0.41, 0.3 pad 0.51)
  Top 0.203: v48.87,27.43 48.37,27.93 J1.34 | 6.15,51.33 6.17,51.35 RESET.4 6.15,51.33 | R1.1 5.77,49.88 C24.2 5.76,50.93 6.15,51.33 | R1.1 5.77,48.02 9.14,44.65 | J3.20 69.29,10.06 v69.29,9.75 | v23.67,28.22 19.18,28.22 14.38,33.02 14.38,39.42 14.37,39.42 9.14,44.65 | 9.14,44.65 | RESET.3 6.13,51.35 6.15,51.33 | R1.1 5.95,48.81 Z4.2
  Route15 0.203: v48.87,27.43 49.66,26.64 49.66,24.28 60.55,13.39 67.33,13.39 69.29,11.43 v69.29,9.75
  Bottom 0.203: v48.87,27.43 47.17,29.13 39.12,29.13 37.77,30.48 29.34,30.48 27.99,29.13 24.59,29.13 v23.67,28.22 | TP33.TP 68.14,10.91 v69.29,9.75
/REST  (via drill 0.3 pad 0.51)
  Top 0.203: v118.39,46.59 118.41,46.56 DEBUG.10 121.44,46.56 122.23,45.77 U$12.P$1 | v48.06,44.22 48.03,44.22 39.29,35.48 39.29,34.16 37.63,32.5 P4.P$2
  Route15 0.203: v48.06,44.22 48.06,44.53 52.3,48.77 83.97,48.77 90.68,42.06 113.87,42.06 v118.39,46.59
ACTLED
  Top 0.203: U1.27 96.09,51.84 95.86,51.61 R48.2
ADC0  (via drill 0.3 pad 0.51)
  Top 0.203: J1.23 51.12,19.34 55.85,14.61 65.76,14.61 66.85,13.51 66.85,9.3 67.59,8.56 71.73,8.56 73.22,7.07 J3.15 73.22,3.72 v74.14,2.79
  Bottom 0.203: TP4.TP 73.18,3.75 v74.14,2.79
ADC1  (via drill 0.3 pad 0.51)
  Top 0.203: v49.3,21.4 48.76,21.4 J1.33 48.62,20.15 48.87,19.9 49.8,19.9 55.5,14.2 63.37,14.2 64.24,13.34 64.24,9.63 65.89,7.98 69.44,7.98 70.68,6.74 J3.17 70.68,4.15 71.07,3.76 v71.7,3.12
  Bottom 0.203: J11.1 10.14,15.14 39.06,15.14 45.33,21.4 v49.3,21.4 | TP5.TP 70.6,4.23 v71.7,3.12
ADC2  (via drill 0.3 pad 0.51)
  Top 0.203: v47.8,22.7 48.12,22.38 J1.35 48.12,20.08 48.77,19.43 49.69,19.43 55.46,13.66 61.04,13.66 61.85,12.85 61.85,8.53 62.36,8.03 64.77,8.03 65.41,7.39 66.5,7.39 68.15,5.74 J3.19 68.14,3.94 v69.09,3
  Bottom 0.203: v47.8,22.7 45.76,22.7 39.06,16 J11.2 | TP6.TP 68.14,3.95 v69.09,3
ADC3  (via drill 0.3 pad 0.51)
  Top 0.203: J1.37 47.62,19.51 54.15,12.98 54.15,9.64 55.08,8.71 60.73,8.71 62.05,7.39 63.91,7.39 64.31,6.99 64.31,5.84 65.17,4.99 J3.21 65.6,4.05 66.6,3.05 v66.62,3.05
  Bottom 0.203: TP7.TP 65.57,4.11 v66.62,3.05
ADC4  (via drill 0.3 pad 0.51)
  Top 0.203: J1.41 46.62,19.69 51.54,14.77 51.54,9.7 52.43,8.81 54.1,8.81 54.76,8.15 58.75,8.15 60.52,6.38 J3.25 60.52,4.07 v61.54,3.05
  Bottom 0.203: TP9.TP 60.53,4.06 v61.54,3.05
ADC5  (via drill 0.3 pad 0.51)
  Top 0.203: J1.43 46.12,19.56 49.2,16.48 49.2,9.42 49.99,8.64 51.97,8.64 52.86,7.75 56.56,7.75 57.98,6.33 J3.27 57.98,3.95 58.93,3 v58.98,3
  Bottom 0.203: TP10.TP 57.99,3.99 v58.98,3
ADC6  (via drill 0.3 pad 0.41, 0.3 pad 0.51)
  Top 0.203: J35.18 64.87,43.18 v64.77,43.08 | v56.46,3.02 55.73,3.76 55.44,4.05 J3.29 55.44,5.67 53.9,7.21 52.43,7.21 51.65,7.99 47.99,7.99 46.86,9.12 v46.86,17.27 46.63,17.5 46.63,18.48 45.62,19.49 J1.45
  Route15 0.203: v61.42,41.81 62.69,43.08 v64.77,43.08
  Bottom 0.203: v61.42,41.81 61.32,41.71 61.32,28.01 57.69,24.38 53.39,24.38 49.01,20 46.52,20 45.16,18.64 45.16,17.63 45.52,17.27 v46.86,17.27 | TP11.TP 55.43,4.06 v56.46,3.02
ADC7  (via drill 0.3 pad 0.41, 0.3 pad 0.51)
  Top 0.203: R56.2 v106.33,50.98 | J1.47 45.12,18.89 45.87,18.14 v45.92,18.14 45.92,14.15 46.35,13.72 46.35,8.46 47.42,7.39 51.1,7.39 52.9,5.6 J3.31 52.9,4.07 53.92,3.05 v53.95,3.05
  Bottom 0.203: v106.33,50.98 105.54,51.77 101.88,51.77 100.94,50.83 89.56,50.83 89.55,50.81 64.94,50.81 62.23,48.11 62.23,28.09 57.91,23.77 53.58,23.77 49.4,19.59 47.38,19.59 v45.92,18.14 | TP12.TP 52.87,4.12 v53.95,3.05
AGND
  Top 0.203: 44.62,21.46 J1.49 | J1.49 44.62,20.27 44.62,18.11 L1.2 | J1.49 44.62,22.8 45.26,23.44 46.53,23.44 47.12,22.86 J1.39 47.12,22.05
BLUE  (via drill 0.3 pad 0.51)
  Top 0.203: J1.65 40.62,18.37 39.19,16.94 32.18,16.94 28.75,13.51 v28.75,8.89 28.75,7.59 30.04,6.31 J3.49 30.02,5 30.02,7.21 | R15.1 17.76,45.74 20.07,43.43 v20.07,29.36
  Route15 0.203: v20.07,29.36 20.07,17.73 18.69,16.36 18.69,11.94 21.74,8.89 v28.75,8.89
  Bottom 0.203: 30.02,7.21 30.01,7.2 TP21.TP 30.01,7.63 v28.75,8.89
BTST
  Top 0.203: U14.21 89.77,25.56 89.61,25.4 89.61,24.13 89.34,23.85 C17.1
CHGND
  Top 0.508: C29.P$1 109.75,80.06 RJ45.CH1
  Top 0.762: RJ45.CH2 RJ45.CH1
CS  (via drill 0.3 pad 0.51, 0.35)
  Top 0.203: J1.48 44.87,27.42 v45.06,27.23 45.06,26.19 45.97,25.27 48.9,25.27 49.48,25.86 49.48,34.29 54.61,39.42 54.61,42.74 64.21,52.34 64.21,55.17 64.92,55.88 J35.8 | J3.34 50.36,13.81 v50.37,13.82
  Route15 0.203: v45.06,27.23 45.09,27.23 45.09,21.79 50.37,16.51 v50.37,13.82
  Bottom 0.203: TP38.TP v50.37,13.81 v50.37,13.82
CTS  (via drill 0.3 pad 0.51)
  Top 0.203: v46.69,30.56 46.87,30.37 J1.40 | J12.5 29.97,58.42 31.85,56.54 31.85,33.68 v31.7,33.53 | J3.26 60.51,11.2 v59.26,11.2
  Route15 0.203: v46.69,30.56 47.14,30.1 47.14,27.05 48.18,26.02 48.18,23.58 59.26,12.5 v59.26,11.2
  Bottom 0.203: v46.69,30.56 46.79,30.66 46.79,31.5 46.41,31.88 44.27,31.88 42.42,33.73 31.9,33.73 v31.7,33.53 | TP36.TP 59.29,11.17 v59.26,11.2
D+
  Top 0.203: Z1.2 117.9,37.51 R5.2 118.2,36.68 118.93,35.95 USB1.3
D-
  Top 0.203: Z2.2 117.93,34.88 117.93,35.76 R6.2 117.97,35.87 118.38,35.87 118.94,35.3 USB1.2
ETH_CS
  Top 0.203: R57.2 86,50.6 80.72,55.88 J35.7
ETH_MISO
  Top 0.203: R51.2 85.76,48.56 83.52,50.8 J35.11
ETH_MOSI
  Top 0.203: R19.2 85.53,47.51 84.78,48.26 J35.13
ETH_SCK
  Top 0.203: R53.2 85.94,49.6 82.19,53.34 J35.9
GMD
  cutout Top: 102.31,33.91 102.31,25.76 103.94,25.76 103.94,33.91
GND  (via drill 0.3 pad 0.41, 0.3 pad 0.51, 0.35, 3.2 pad 6)
  Top 0.203: C13.1 v96.62,48.06 | C33.1 95.66,48.8 v95.66,48.16 | U1.29 97.09,54.1 v96.7,54.48 | v107.14,54.97 106.28,54.97 RN1.1 RN1.2 RN1.3 | RN1.3 RN1.4 RN2.1 106.69,57.1 v107.14,57.1 | RN1.3 v107.14,56.03 | U1.48 103.77,60.13 v103.79,60.15 | U1.3 99.59,63.29 C23.1 100.1,64.85 v100.13,64.87 100.13,65.63 99.52,66.23 C1.1 | U1.9 96.59,63.33 96.52,63.4 96.52,64.14 C22.1 R23.1 C21.1 94.77,64.72 v93.88,64.72 | U1.19 94.76,57.13 v94.8,57.1 | C19.1 91.1,58.63 U1.16 | 91.01,60.88 C18.1 91.65,60.88 91.95,60.58 v91.95,59.87 92.19,59.63 U1.14 | C20.1 v89,55.27 | C26.1 v88.85,54.2 | C12.1 101.22,45.19 v101.25,45.16 101.18,45.23 Y1.4 | Y1.2 95.44,46.08 C11.1 94.77,46.99 v94.72,47.04 | C30.1 v107.44,52.83 | R20.2 116.13,38.41 v116.08,38.46 | D6.1 116.21,32.62 v116.03,32.44 | USB1.5 USB1.9 120.17,39.52 v120.14,39.55 | 93.41,55.12 U1.23 v94.8,55.15 | C65.2 v90.53,21.74 | C56.2 91.87,21.77 v91.9,21.74 | C62.2 v93.27,21.74 | C64.2 94.76,24.37 v94.8,24.34 | C57.2 96.17,25.21 v96.17,24.34 | v42.75,30.35 42.87,30.23 J1.56 | L1.1 44.72,16.09 v44.41,15.79 | U3.P$1 U3.5 71.42,27.84 C4.2 | C63.2 82.96,30.23 v82.76,30.02 | 56.62,20.49 | 55.12,21.69 55.14,21.72 | 55.62,21.71 55.63,21.72 | 56.12,21.7 56.13,21.72 | LED1.2 123.5,42.52 v123.52,42.5 | DEBUG.3 115.22,50.37 v114.84,49.99 115.72,49.1 DEBUG.5 | DEBUG.9 114.86,46.56 | v114.66,47.58 114.66,46.76 114.86,46.56 | C55.2 80.36,29.44 v80.39,29.41 | C54.2 82.13,32.83 v82.15,32.82 | U13.4 77.66,32.19 v77.4,31.93 | U13.1 78.14,30.69 U13.EP 77.14,31.69 U13.6 75.05,31.69 v74.91,31.83 | D1.1 v114.68,73.94 | C14.1 v99.14,70.94 | R34.2 v88.85,33.71 | USB2.5 121.42,78.25 121.77,77.91 v121.77,77.78 121.59,77.6 USB2.4 119.86,77.6
  Top 0.203: USB2.5 USB2.9 | U$2.P$1 113.87,46.56 114.86,46.56 | 56.72,22.68 v56.57,22.84 56.16,22.84 | 56.72,22.68 57.53,22.68 57.72,22.49 J1.77 | v79.68,23.42 C59.2 78.96,24.47 C47.2 | C58.2 81.13,24.42 v81.13,23.42 | R55.2 v117.33,72.8 | C31.2 v88.62,56.64 | C28.2 v89.79,60.25 | R33.2 90.17,33.33 v90.17,33.68 90.17,33.53 R10.1 | C60.2 v97.36,24.97 | C6.1 71.94,24.66 v71.94,24.23 | C5.2 66.58,23.74 v66.58,22.89 | C7.1 67.97,23.6 v68.02,23.55 | C3.1 v68.94,23.55 | C2.1 69.93,23.57 v69.95,23.55 | 52.86,22.55 51.92,22.55 51.62,22.26 J1.21 | 52.86,22.55 53.12,22.29 J1.15 | 52.86,22.55 54.18,22.55 54.62,22.11 J1.9 J1.7 | 54.61,22.25 54.62,22.24 | 56.16,22.84 55.73,22.84 55.59,22.7 | 55.59,22.7 55.12,22.23 J1.7 | J1.5 55.62,22.66 55.59,22.7 | 56.16,22.84 56.12,22.8 J1.3 | 56.72,22.68 56.62,22.58 J1.1 J1.7 | BUTTON.3 BUTTON.4 | 6.76,52.74 v7.34,53.33 6.87,52.85 RESET.2 RESET.1 2.65,53.64 v2.79,53.78 | Z6.1 117.71,74.88 v117.45,74.63 | Z1.1 116.89,37.57 116.33,37.57 v116.13,37.37 | Z2.1 116.23,34.85 v116.11,34.98 | X4.6 4.93,69.49 v3.56,69.49 | BUTTON.4 7.25,43.25 Z3.1 | BUTTON.4 6.1,43.19 v6.1,42.39 | R37.2 v103.52,3.24 v103.53,3.23 | R38.1 v98.38,3.23 v98.37,3.23 | C24.1 4.75,49.86 v3.99,49.86 | v119.84,26.95 119.84,26.6 119.28,26.04 | Z5.1 118.9,78.56 119.24,78.22 120.15,78.22 USB2.5 | Z4.1 7.53,49.82 v7.54,49.81 | J3.33 50.36,4.02 v51.44,2.95 | 63.3,3.68 63.06,3.92 J3.23 | 63.3,3.68 | 63.3,3.68 v64.01,2.97 | J3.42 40.26,11.15 v40.26,8.61 | J3.59 17.34,3.56 v18.21,2.69 | U14.18 87.17,26.83 v86.97,27.03 87.27,27.33 U14.17 88.97,27.33 U14.PAD@3 88.77,26.83 U14.18
  Top 0.254: S4.5 S4.2 | 89.45,56.69 C31.2 89.47,56.62 | C19.1 90.41,59.32 C28.2 | C25.2 v104.5,63.7 | U3.2 69.62,27.84 69.65,27.82 | J35.23 76,36.73 v76.43,36.73 | J35.24 65.53,35.56 v65.25,35.84
  Top 0.305: 117.22,25.86 116.46,25.86 116.46,26.59 116.61,26.75 v116.61,26.98 | 117.22,25.86 117.18,25.82 J4.1 117.81,25.94 117.94,26.06 | v117.43,26.98 117.43,26.06 117.22,25.86 | v118.21,27 118.21,26.34 117.94,26.06 | v119,26.98 119,26.04 119.28,26.04 | 118.95,26.04 117.96,26.04 117.94,26.06 | v115.78,27 115.78,26.14 115.55,25.91 | 37.03,22.89 37.03,22.05 J1.76 | J1.76 38.12,23.14 v38.2,23.14 | J1.76 36.84,22.23 v35.76,22.23 | J1.76 36.47,22.04 v35.74,21.31 34.8,21.31 v34.77,21.29 | v35.76,22.23 34.87,22.23 v34.77,22.12 | v35.76,22.23 35.76,23.01 v35.79,23.04 | v35.79,23.04 34.87,23.04 v34.85,23.01 | v35.79,23.04 36.63,23.04 37.02,22.64 J1.76 | v69.65,27.33 69.65,27.82 U3.P$1
  Top 0.381: C29.P$2 111.13,75.16 v111.61,75.64
  Top 0.508: v74.75,25.17 73.56,25.17 U2.2
  Bottom 0.203: TP8.TP 50.37,4.01 v51.44,2.95 | TP13.TP 63.04,3.94 v64.01,2.97 | TP42.TP 40.26,11.04 v40.26,8.61 | TP26.TP 17.39,3.52 v18.21,2.69
  other vias: 115.43,4.4 113.34,5.44 69.62,28.32 77.37,30.86 58.83,23.06 58.85,22.25 58.85,21.41 58.83,20.47 59.72,23.04 59.74,22.2 59.77,21.36 59.72,20.47 27.28,36.37 3.12,80.7 9.17,84.15 2.92,78.89 7.37,81.71 61.44,62.99 83.7,72.42 56.16,53.64 73.63,65.13 64.04,63.88 77.5,71.25 60.48,60.88 47.45,53.62 9.25,87.15 5.44,80.49 115.42,86.13 113.03,71.43 112.63,69.6 112.6,65.71 114.12,61.77 112.55,56.95 109.98,60.78 114.89,57.61 120.09,54.46 116.92,54.46 111.2,52.86 110.31,50.4 104.98,50.9 101.78,47.14 108.13,47.32 103.76,45.06 108.16,44.93 103.74,39.73 105.79,39.93 105.95,38.36 108.33,39.3 116.67,30.61 118.52,30.46 121.11,30.43 123.83,30.43 123.65,19.56 119.99,19.64 116.23,19.56 106.17,20.55 109.15,20.65 112.14,20.58 107.75,17.27 114.18,10.44 111.61,9.3 117.94,6.94 120.27,7.93 120,4 4.5,85.5 120,85.5 58.2,55.15 119.13,71.58 71.5,21.79 76.99,27.76 76.91,29.36 89.64,40.18 91.77,39.6 97.74,34.6 98.35,33.4 91.57,40.72 88.7,42.65 79.94,40.03 47.78,36.37 49.5,36.09 39.98,41.43 40.03,38.94 39.9,44.3 43.48,47.78 41.99,46.48 27.15,34.7 25.65,34.9 27.48,31.55 111.76,30.74 111.81,29.14 107.5,36.91 113.01,41.07 115.9,39.93 102.87,41.28 108.33,41.3 112.3,37.19 103.36,51 93.14,61.34 88.55,63.27 91.04,63.22 92.97,63.35 88.06,60.71 84.41,61.37 81,59.82 85.09,55.81 83.04,59.16 85.14,59.16 105.9,60.73 97.44,58.78 97.46,56.21 100.08,58.65 100,56.39 98.89,57.56 103.08,52.99 107.34,51.74 92.64,38.33 116.61,28.98 105.9,17.65 101.76,19.48 101.63,20.52 101.53,22.58 101.55,24.31 98.28,23.09 98.2,21.11 98.07,19.94 100.46,21.16 100.43,19.97 118.75,18.06 122.02,18.04 115.73,8.1 111.74,7.32 68.71,22 71.33,19.79 66.02,21.46 67.9,19.64 61.88,20.37 68.25,20.7 72.85,21.13 71.38,22.94 60.99,20.55 59.23,27.13 71.07,24.06 99.88,65.89 70.49,33.81 47.7,50.88 47.75,56.69 69.47,20.45 111.03,47.91 112.96,47.8 114.81,48.52 103.18,46.26 105.9,44.96 110.67,44.81 32.97,22.33 31.98,21.26 35,27.41 25.53,31.55 46.63,34.44 34.57,36.53 34.37,35.46 49.99,55.24 49.94,52.63 76.28,68.48 77.22,69.52 78.06,68.18 74.32,66.52 77.3,66.07 79.28,69.98 79.23,74.47 81.54,74.5 78.67,72.57 80.8,71.38 83.14,75.57 84.13,76.66 85.14,77.81 84.76,74.19 86.26,75.72 87.22,86.08 85.05,79.53 89.31,83.03 98.61,86.79 100.03,84.66 96.57,83.11 108.44,83.75 111.64,84.42 113.69,83 116.29,80.22 117.21,78.88 113.13,77.93 114.38,76.73 113.03,73.79 111.86,72.67 111.41,71.05 111.31,69.42 108.49,73.03 107.14,67.29 110.01,64.97 108.44,63.5 108.38,61.6 110.14,56.31 110.16,54.79 110.19,53.42 100.38,47.19 102.36,45.06 60.55,59.41 60.45,57.23 60.53,55.93 60.55,54.43 62.59,60.48 45.52,49.2 80.57,69.6 82.91,69.57 82.83,71.1 109.96,7.77 109.38,17.98 110.75,19.23 4.5,4 28.14,37.77 11.43,20.75 33.2,21.06 96.85,20.37 96.47,21.67 71.25,20.7 66.95,20.19 50.65,39.4 49.58,38.18 48.54,37.19 47.24,35.53 72.82,19.91 87.76,20.37 106.28,12.32 62.61,59.33 62.64,56.85 62.69,55.52 62.61,54.1 61.52,18.16 110.67,81.18 111.71,80.32 113.01,79.17 114.38,77.93 115.65,76.71 114.94,80.85 113.62,81.92 109.91,85.75 108.51,87.35 112.5,83.11 100.21,86.79 97.46,84.53 90.63,87.2 87.15,84.46 85.7,83.01 85.09,81.15 80.77,73.13 80.75,67.82 80.77,66.37 82.83,67.87 82.76,66.14 82.63,64.16 79.66,64.97 108.64,59.92 103.63,49.51 105.54,49.58 103.74,47.27 105.57,47.35 108.03,48.41 51.85,40.8 52.95,42.1 54.25,43.5 55.75,44.9 57.25,46.5 58.75,48 44.37,34.8 44.68,36.37 45.92,37.72 46.96,38.73 48.23,40.01 49.73,41.43 51.23,43 52.91,44.75 54.81,46.66 56.08,47.96 59.61,51.44 62.05,51.23 74.45,3.96 77.11,3.91 79.55,3.68 82.12,4.85 84.63,4.85 87.17,4.93 89.74,4.88 104.93,13.36 102.77,14.17 100.99,16.54 102.39,16.44 100.36,18.21 106.78,16.51 104.93,19.36 104.73,21.77 104.68,23.73 113.06,24.87 111.66,24.77 111.71,28.07 112.58,36.15 111,36.3 108.89,36.7 111.74,50.57 109.96,47.91 115.55,53.24 103.91,65.51 103.3,63.17 105.69,68.2 107.7,68.28 105.69,65.13 102.85,70.77 102.92,69.11 108.41,75.29 108.33,77.4 88.83,80.65 88.9,78.89 88.85,77.19 87.23,74.3 87,72.49 15.7,52.88 13.97,44.22 86.85,44.05 85.83,43 84.23,41.66 82.78,39.63 93.35,40.79 84.76,39.52 86.79,39.47 83.52,33.25 84.97,33.53 96.5,34.34 99.27,34.67 75.79,19.68 79.81,19.46 81.51,18.24 92.97,13.41 95.08,11.84 97.64,9.27 96.27,14.94 98.61,13.18 100.49,11.15 102.67,8.69 105.01,6.05 96.98,6.28 96.98,3.86 95,3.84 92.87,6.15 100.59,23.39 63.43,18.14 60.61,18.85 62.03,19.05 97.64,15.52 98.78,14.38 104.3,14.43 107.95,11.41 108.31,8.99 104.9,3.96 103.58,7.19 101.37,9.83 99.06,11.96 96.19,10.49 97.06,13.57 98.91,7.95 99.85,7.19 97.06,5.01 102.19,2.87 92.71,3.91 92.69,10.01 92.48,12.22 86.08,18.37 87.91,18.29 90.48,18.29 92.69,18.16 94.74,18.11 96.47,18.16 97.97,18.11 95.28,29.03 96.78,29.26 98.53,29.21 98.3,28.02 96.42,28.09 107.32,28.93 105.62,29.01 104.88,28.07 104.73,25.58 106.15,22.68 107.65,22.07 115.83,22.43 117.55,22.4 121.39,26.04 122.99,26.01 121.92,23.6 86.64,41.35 104.27,52.86 110.29,51.94 110.09,63.07 76.03,65.15 62.61,63.5 38.38,42.67 31.24,29.54 31.4,27.74 32.82,26.29 27.79,27.76 30.86,24.84 34.83,24.89 30.71,21.19 29.21,23.19 27.56,21.44 23.9,21.13 23.68,25.81 23.62,24.03 28.68,25.68 18.95,25.88 18.88,23.45 19,20.35 18.11,17.86 15.85,17.17 13.92,18.11 15.32,20.27 15.5,22.91 15.6,25.63 12.7,28.09 12.7,26.04 12.68,24.06 12.7,21.92 11.89,87.07 15.19,87.12 18.75,87.07 21.77,87 24.28,87.07 26.9,87.2 11.89,83.95 15.27,83.95 18.54,83.95 21.46,83.79 24.43,83.79 27.13,83.79 38.48,86.97 42.32,86.97 46.28,87 49.68,86.97 52.83,86.97 56.16,86.97 38.51,84.05 46.61,84.38 49.86,84.61 52.96,84.56 55.98,84.51 56.11,81.79 38.91,81.36 43.23,80.98 46.63,80.98 50.09,80.85 52.76,80.85 10.64,80.42 15.06,80.42 18.85,80.59 21.56,80.59 24.41,80.59 27.3,80.59 32.21,80.72 36.75,80.19 6.55,78.99 2.97,76.58 3.02,74.42 5.87,76.25 9.09,71.35 12.7,70.99 13.18,68.45 11,74.47 9.5,77.06 54.91,80.72 68.71,86.94 72.36,86.92 77.17,86.94 81.08,87.1 86.16,87.25 68.68,83.79 72.52,83.54 77.14,83.49 81.1,83.49 68.38,80.85 72.47,80.62 76.76,80.62 81.08,80.44 84.07,85.06 113.13,85.5 115.34,83.64 118.14,80.57 116.61,82.25 114.05,87.6 84.81,69.88 84.76,66.75 84.66,64.21 90.07,67.26 92.46,67.26 92.2,65.51 89.69,65.28 106.1,66.62 115.93,2.11 104.9,2.01 97.31,2.24 60.12,44.48 58.78,43.38 57.58,42.21 56.67,40.69 63.88,44.5 63.8,41.17 59.44,41.1 59.44,38.05 58.32,37.21 57.23,36.17 60.12,36.27 64.72,38.51 63.27,38.2 63.09,36.47 64.59,36.91 78.87,28.65 78.36,27.23 75.01,29.79 78.16,23.01 80.42,22.4 78.03,19.63 74.19,20.04 64.82,21.08 48.06,33.83 50.7,37.31 52.1,38.4 53.34,39.62 53.72,41.07 61.29,46.81 63.3,46.84 65.07,46.96 64.52,56.77 41.53,42.93 43.26,44.68 44.32,45.75 35,41.02 28.09,41.1 26.19,41.02 24.49,41.1 24.51,43.61 24.49,46.33 24.49,48.49 27.94,48.87 28.04,46.51 27.97,43.97 26.44,38.61 24.51,38.66 24.13,35.69 23.37,31.57 19.15,35.43 18.97,33.38 17.3,32.08 18.8,29.77 15.27,28.68 16.92,27.46 11.81,34.9 15.32,36.98 16.51,38.15 17.65,40.97 16.41,42.01 15.09,43.23 12.83,44.98 8.94,46.89 8.81,48.74 6.07,46.66 3.53,48.36 3.73,46.58 3.12,41.5 5.49,41.25 8.43,41.68 10.77,39.85 14.45,13.74 11.73,11.3 14.78,10.85 14.76,6.96 14.96,3.43 14.68,5.08 97.84,82.07 100.63,82.07 95.1,78.99 110.24,58.42 119.58,43.87 121.28,43.97 123.22,43.92 122.76,37.21 122.86,35.26 122.94,33.93 115.7,29.84 113.51,27.03 111.94,26.19 108.38,2.41 82.8,44.58 81.1,42.32 79.22,44.53 78.84,46.84 81.1,46.81 83.69,46.84 86.89,51.89 85.24,53.29 83.69,54.79 80.39,54.51 78.36,54.48 78.49,51.59 80.24,51.54 81.99,51.51 78.44,56.92 80.24,56.82 82.47,61.54 79.55,59.26 85.32,57.4 85.45,60.66 52.93,53.31 54.99,55.96 28.63,71.88 38.13,71.75 48.06,71.88 57.73,71.75 65.99,71.83 71.91,71.63 66.04,67.46 57.94,67.28 38.25,66.14 28.6,65.91 38.25,59.59 48.16,59.36 57.73,59.31 38.25,54.48 38.23,48.79 37.19,45.26 35.81,43.18 35.61,51.33 35.36,47.5 35.69,56.92 34.21,61.34 31.65,63.45 24.77,65.81 20.29,65.86 20.83,70.64 15.82,76.1 22.17,76.1 28.17,76.1 35.38,76.02 44.2,76.28 51.54,75.87 32.26,68.71 54.2,67.11 54,61.59 53.49,58.47 42.82,55.07 42.6,50.85 42.11,61.72 70.71,75.77 76.4,76.45 42.16,71.63 6.91,9.63 9.09,7.65 11.28,5.05 12.4,8.51 9.19,2.95 12.06,2.67 107.24,84.69
  pour Top (isolate 0.279, no thermals): 114.58,27.59 114.58,26.01 115.19,25.4 120.04,25.4 120.04,27.54 120.09,27.59
  pour Top (isolate 0.279, no thermals): 38.48,23.57 34.75,23.57 34.21,23.04 34.21,21.18 34.67,20.73 37.47,20.73 37.59,20.85 37.59,21.92 38.63,22.96 38.63,23.42
  pour Top (isolate 0.279, no thermals): 54.53,19.68 54.53,22.17 54.84,22.48 54.99,22.63 55.7,22.63 56.44,23.37 56.97,23.37 60.1,23.37 60.17,23.29 60.35,23.11 60.35,22.53 60.35,20.47 60.05,20.17 59.51,19.63 56.46,19.63 54.56,19.63 54.53,19.66
  pour Route2 (isolate 0.508): 0.73,89.13 0.63,88.08 0.73,0.41 124.51,0.41 124.51,89.13
  pour Route15 (isolate 0.508, rank 5): 1.17,88.41 1.17,0.97 124.21,0.97 124.56,1.32 124.56,88.17 123.8,88.93 1.7,88.93
  cutout Top (isolate 0.279): 52.68,28.09 52.83,27.94 53.57,27.94 53.57,31.5 54.46,32.38 57.71,32.38 57.94,32.61 57.94,33.1 52.68,33.1
  cutout Top (isolate 0.279): 56.57,28.7 56.57,27.2 58.22,27.2 58.24,27.23 58.32,27.3 58.32,28.7 58.29,28.73 56.57,28.73 56.54,28.7
  pour Top (isolate 0.508, rank 5): 1.19,87.73 1.19,2.77 3.38,0.58 3.43,0.53 12.01,0.53 122.89,0.53 124.54,2.18 124.54,87.1 122.4,89.23 2.67,89.23 1.19,87.76
  pour Bottom (isolate 0.508, rank 5): 1.22,87.81 1.22,2.95 3.56,0.61 122.94,0.61 124.56,2.24 124.56,87.05 122.4,89.2 2.59,89.2 1.24,87.86 1.22,87.83
  cutout Top (isolate 0.279): 64.14,28.37 64.14,27.38 67.59,27.38 67.59,28.32 64.47,28.32 64.41,28.37
  cutout Top (isolate 0.279): 90.35,69.7 90.58,69.93 90.58,73.41 93.42,76.25 95.63,76.25 95.99,75.9 95.99,74.75 95.91,74.83 93.65,74.83 92,73.18 92,68.81 90.42,68.81 90.32,68.91 90.32,69.7 90.35,69.72 90.35,69.75 90.37,69.75 90.35,69.75
  cutout Top (isolate 0.279): 93.22,78.31 93.22,74.93 94.95,73.2 96.39,73.2 96.39,78.31
  cutout Top: 81.92,27.69 81.92,26.42 85.85,26.42 85.85,27.69
  cutout Top: 16,9.53 16,6.73 91.57,6.73 91.57,9.27 16.26,9.27
  cutout Top: 117.73,49.91 117.73,48.77 119.38,48.77 119.38,49.91
  cutout Top: 66.04,64.14 66.04,34.92 77.09,34.92 77.09,64.26 66.04,64.26
GPIO0  (via drill 0.3 pad 0.51)
  Top 0.203: v41.3,27.36 41.37,27.43 J1.62 41.37,31.69 42.04,32.36 42.04,35.89 v51.61,45.47 | J3.48 32.58,13.17 v33.15,13.74 | J35.16 v65.08,45.72
  Route15 0.203: v41.3,27.36 41.3,22.23 33.15,14.07 v33.15,13.74 | v65.08,45.72 51.87,45.72 v51.61,45.47
  Bottom 0.203: TP45.TP 32.58,13.17 v33.15,13.74
GPIO1  (via drill 0.3 pad 0.51)
  Top 0.203: v40.69,31.04 40.87,30.86 J1.64 | J3.50 30.04,13.48 v30.89,14.33
  Route15 0.203: v40.69,31.04 40.69,22.35 34.21,15.88 32.44,15.88 v30.89,14.33
  Bottom 0.203: TP46.TP 30.01,13.45 v30.89,14.33
GREEN  (via drill 0.3 pad 0.51)
  Top 0.203: J1.63 41.12,18.3 39.36,16.54 34.11,16.54 31.42,13.84 v31.42,9.22 31.42,8.03 32.58,6.87 J3.47 | R13.1 11.62,51.44 14.44,51.44 22.4,43.48 v22.4,29.97
  Route15 0.203: v22.4,29.97 22.4,16.36 21.39,15.34 21.39,12.09 22.4,11.07 29.57,11.07 v31.42,9.22
  Bottom 0.203: TP20.TP 32.58,8.06 v31.42,9.22
ILIM
  Top 0.203: U14.10 89.77,31.96 R33.1
LINKLED
  Top 0.203: U1.25 95.09,52.06 95.05,52.02 91.72,52.02 R47.2
MISO  (via drill 0.3 pad 0.51)
  Top 0.203: J1.50 v44.37,26.6 v44.37,26.59 44.37,26.04 45.7,24.71 49.61,24.71 49.94,25.04 49.94,33.96 55.02,39.04 55.02,42.57 63.25,50.8 J35.12 | J3.36 v47.82,13.84 v47.83,13.84
  Route15 0.203: v44.37,26.59 44.63,26.34 44.63,21.36 47.83,18.16 v47.83,13.84
  Bottom 0.203: TP39.TP 47.79,13.8 v47.83,13.84
MODE  (via drill 0.3 pad 0.41, 0.3 pad 0.51)
  Top 0.203: BUTTON.1 BUTTON.2 7.65,44.75 Z3.2 13.16,39.24 13.16,32.51 18.34,27.33 23.8,27.33 26.82,30.35 v27.33,30.35 | v48.82,30.4 48.87,30.35 J1.32 | J3.18 70.68,10.98 v71.81,9.86
  Route15 0.203: v48.82,30.4 50.34,28.88 50.34,24.41 60.86,13.89 68.22,13.89 71.81,10.31 v71.81,9.86
  Bottom 0.203: v48.82,30.4 48.16,29.74 39.27,29.74 37.87,31.14 28.75,31.14 27.96,30.35 v27.33,30.35 | TP32.TP 70.6,11.06 v71.81,9.86
MOSI  (via drill 0.3 pad 0.51, 0.35)
  Top 0.203: J1.52 43.87,27.28 43.74,27.15 v43.74,25.83 43.74,25.43 44.97,24.19 49.9,24.19 50.34,24.64 50.34,33.57 55.63,38.85 55.63,42.27 61.62,48.26 J35.14 | J3.38 45.28,14 v45.26,14.02
  Route15 0.203: v43.74,25.83 44.15,25.43 44.15,17.65 45.26,16.54 v45.26,14.02
  Bottom 0.203: TP40.TP 45.23,13.99 v45.26,14.02
N$1
  Top 0.203: R22.1 117.85,39.27 R21.1 R20.1 118.31,38.41 118.59,38.13 118.59,36.93 118.92,36.6 USB1.4
N$2
  Top 0.203: RGB.RED R12.2
N$3
  Top 0.203: 91.66,20.3 D5.A 91.71,20.6 R44.1
N$4
  Top 0.203: J7.1 87.89,22.07 R44.2
N$5
  Top 0.203: USB2.1 119.24,75.65 118.77,75.18 118.77,74.5 118.21,73.94 D1.2
  Top 0.254: D1.2 F2.P$1
N$6
  Top 0.254: U3.1 66.51,28.39
  Top 0.381: 66.51,28.39 L2.P$1
N$7
  Top 0.203: R11.2 71.12,26.09 70.62,26.59 U3.4
N$8  (via drill 0.3 pad 0.51)
  Top 0.203: R19.1 91.41,47.85 v91.9,47.85 | v100.74,54.51 100.09,53.86 U1.35 100.09,51.95 100.81,51.24 100.81,50.71 R60.1
  Route15 0.203: v91.9,47.85 93.42,47.85 96.22,50.65 99.92,50.65 100.66,51.39 100.66,54.44 v100.74,54.51
N$9  (via drill 0.3 pad 0.51)
  Top 0.203: v113.52,32.06 113.52,28.61 112.11,27.2 108.18,27.2 107.43,27.95 R8.2
  Top 0.254: S4.3 S4.6
  Bottom 0.203: S4.6 122.58,57.25 122.07,56.74 122.07,47.8 113.84,39.57 113.84,32.38 v113.52,32.06
N$10
  Top 0.203: 113.55,51.53 U$1.P$1
  Top 0.508: DEBUG.1 116.52,51.56 U$1.P$1 113.62,51.54 D8.2
N$11  (via drill 0.3 pad 0.51)
  Top 0.203: R51.1 92.65,48.56 v92.86,48.77 | v100.08,55.14 100.06,55.13 100.06,54.41 99.59,53.94 U1.34 99.59,51.44 100.4,50.63 R59.1
  Route15 0.203: v92.86,48.77 92.86,49.23 94.97,51.33 98.86,51.33 99.62,52.09 99.62,53.77 100.08,54.23 v100.08,55.14
N$12
  Top 0.203: RN1.8 103.74,54.98 103.58,55.13 U1.38
N$13  (via drill 0.3 pad 0.51)
  Top 0.203: R53.1 91.43,49.23 v92.05,49.23 | U1.33 99.09,54.53 v99.06,54.56
  Route15 0.203: v99.06,54.56 99.06,52.53 98.45,51.92 94.74,51.92 v92.05,49.23
N$14
  Top 0.762: J4.2 113.86,23.94 112.28,22.36 Q2.3
  pour Top (isolate 0.279, no thermals): 119.81,23.39 115.17,23.39 113.52,21.74 108.74,21.74 108.74,23.04 110.98,23.04 111,23.01 111,23.67 113.16,23.67 113.92,24.44 119.81,24.44
N$15
  Top 0.203: U1.39 104.64,55.63 104.75,55.53 RN1.7
N$16
  Top 0.203: U1.40 104.17,56.13 104.27,56.04 105.26,56.04 RN1.6
N$17
  Top 0.203: U1.41 105.21,56.63 RN1.5
N$18
  Top 0.203: F1.P$1 117.95,32.74 D6.2
  Top 0.457: USB1.1 119.13,34.65
  Top 0.508: 119.13,34.65 118.21,33.73 F1.P$1
N$19
  Top 0.203: R14.2 121.05,42.5 LED1.1
N$20
  Top 0.203: U1.42 104.13,57.13 104.51,57.52 RN2.8
N$21  (via drill 0.3 pad 0.51)
  Top 0.203: v92.15,50.19 91.74,50.6 R57.1 | v98.09,54.41 98.59,53.91 U1.32 98.59,51.47 99.06,51 99.21,51 99.44,50.77 R24.1
  Route15 0.203: v92.15,50.19 94.34,52.38 97.64,52.38 98.09,52.83 v98.09,54.41
N$22
  Top 0.203: U1.43 104.02,57.63 104.45,58.07 RN2.7
N$23
  Top 0.203: U1.44 103.94,58.13 104.38,58.57 RN2.6
N$24
  Top 0.203: U1.45 103.64,58.63 104.13,59.12 RN2.5
N$25
  Top 0.203: U1.22 92.26,55.63 91.9,55.27 91.9,54.66 91.44,54.2 C26.2
N$26
  Top 0.203: RGB.BLUE 10.85,46.03 R15.2
N$27
  Top 0.203: RGB.GREEN 10.85,49.73 R13.2
N$28
  Top 0.203: U1.10 96.09,62.97 95.86,63.19 R23.2
N$29  (via drill 0.3 pad 0.51)
  Top 0.203: 99.57,67.62 99.42,67.62 R32.1 | 100.18,67.59 v100.36,67.41 | C1.2 100.16,67.62
  Top 0.254: v100.36,67.41 100.16,67.62 99.42,67.62
  Route15 0.203: v100.36,67.41 100.3,67.41 99.57,68.15 99.57,68.76 101.07,70.26 101.07,70.97 103.33,73.23 103.33,74.84 102.5,75.67 101.76,75.67 RJ45.R4
N$30  (via drill 0.3 pad 0.51)
  Top 0.203: C14.2 98.3,68.86 R41.1 98.94,69.44 v99.09,69.44 | R40.1 v95.23,68.02 v95.22,68.02
  Route15 0.203: v95.22,68.02 96.65,69.44 v99.09,69.44 100.23,70.58 100.23,71.81 100.61,72.19 100.61,75.18 100.79,75.36 101.22,75.36 101.93,74.65 RJ45.R3
N$31
  Top 0.203: U1.31 98.09,51.21 98.46,50.84 98.46,50.18 R26.1 98.48,49.21 R50.1
N$32
  Top 0.203: C11.2 94.89,45.23 Y1.3 97.51,46.4 R26.2 97.59,50.24 U1.30
N$33
  Top 0.203: C12.2 99.51,46.15 Y1.1 98.45,47.21 R50.2
N$35
  Top 0.203: C31.1 U1.20
N$36
  Top 0.203: R52.2 7.05,56.21 LED2.1
N$37  (via drill 0.3 pad 0.51)